# Altium project BEAGLEBONEBLACK.PrjPcb (part 3 of 6)

## Sheet P03_Processor 1 of 3, JTAG Header.SchDoc
size C
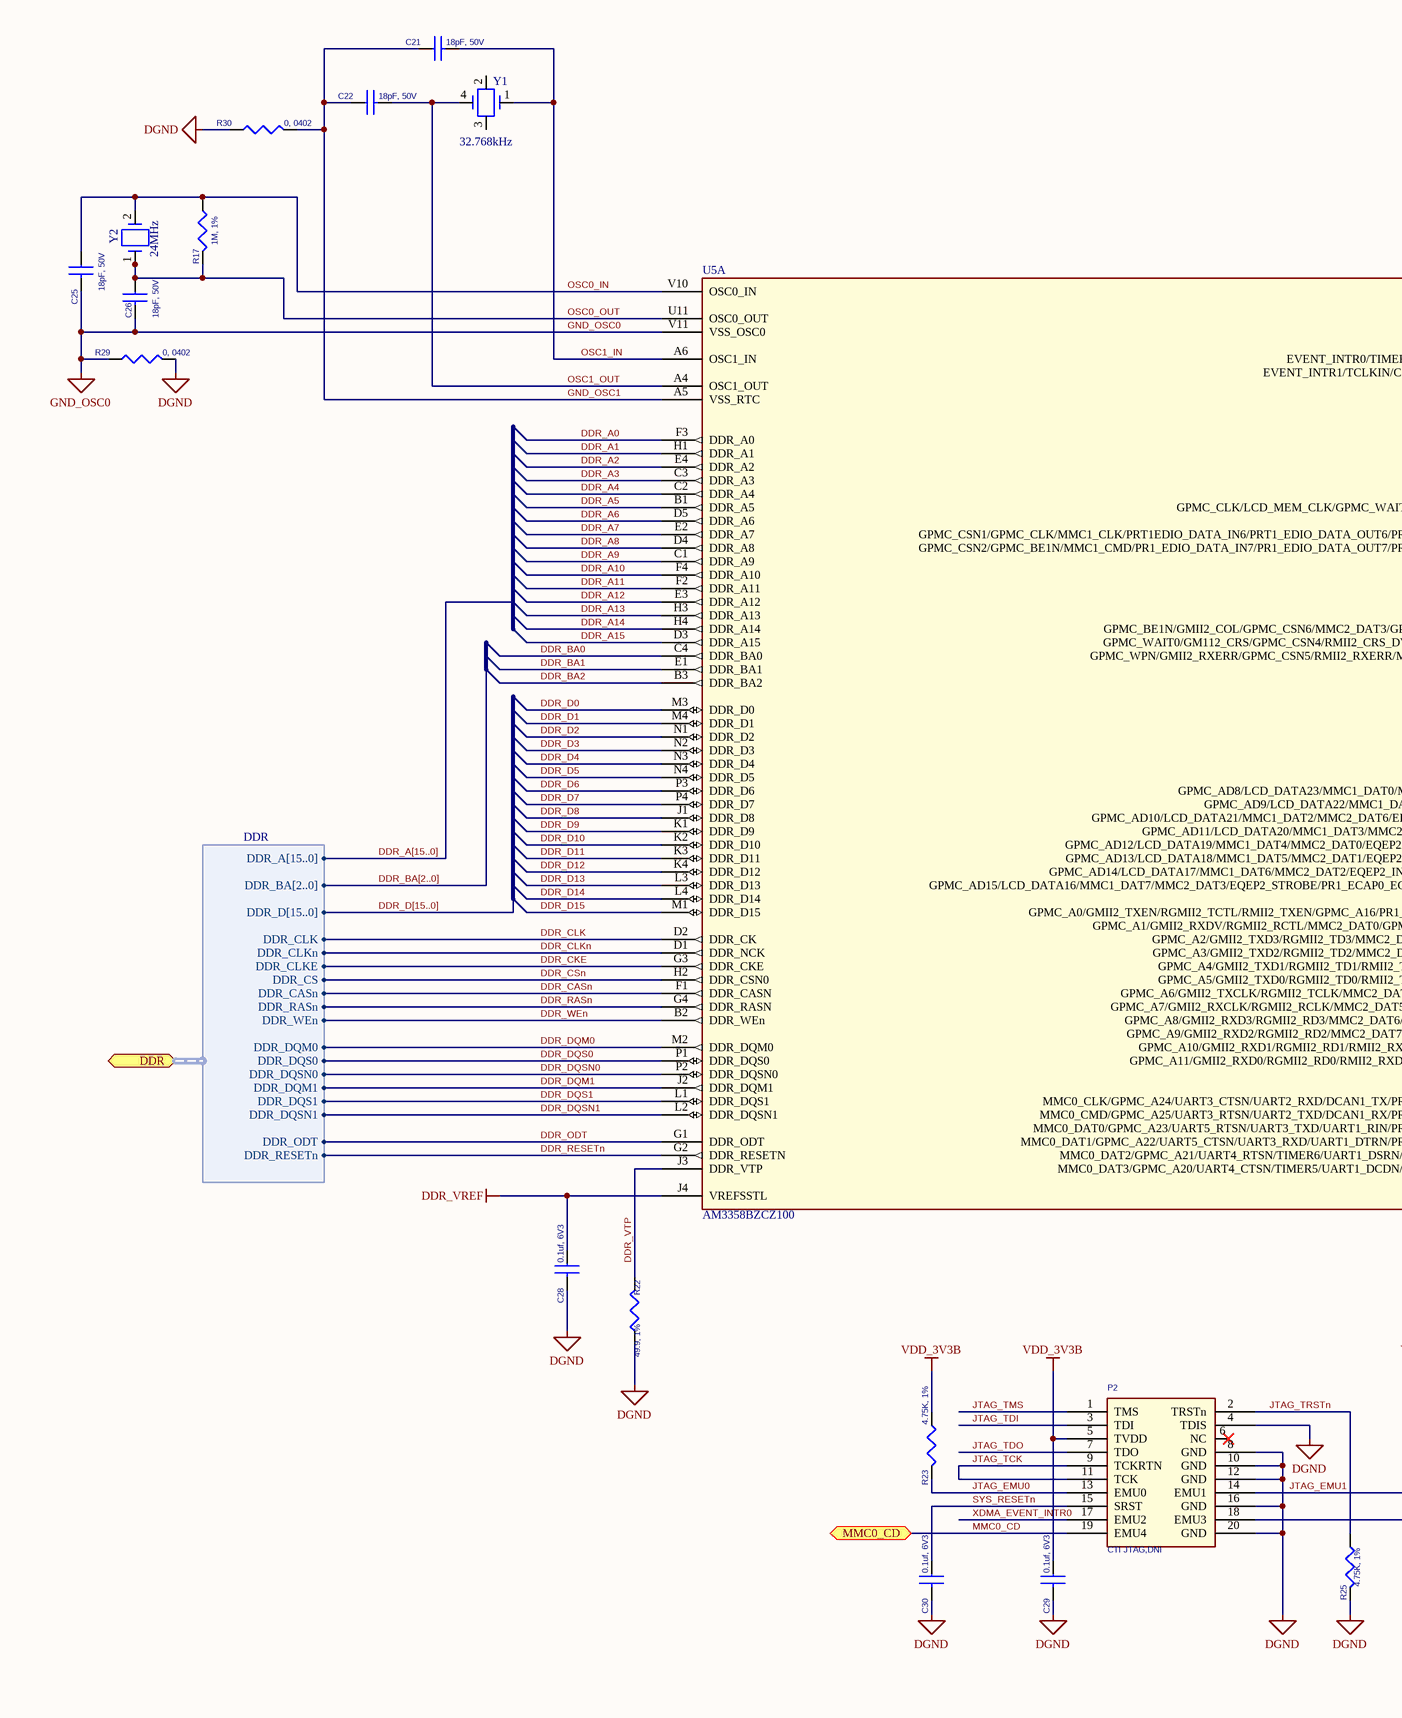
[diagram p7: P03_Processor 1 of 3, JTAG Header.SchDoc, left]
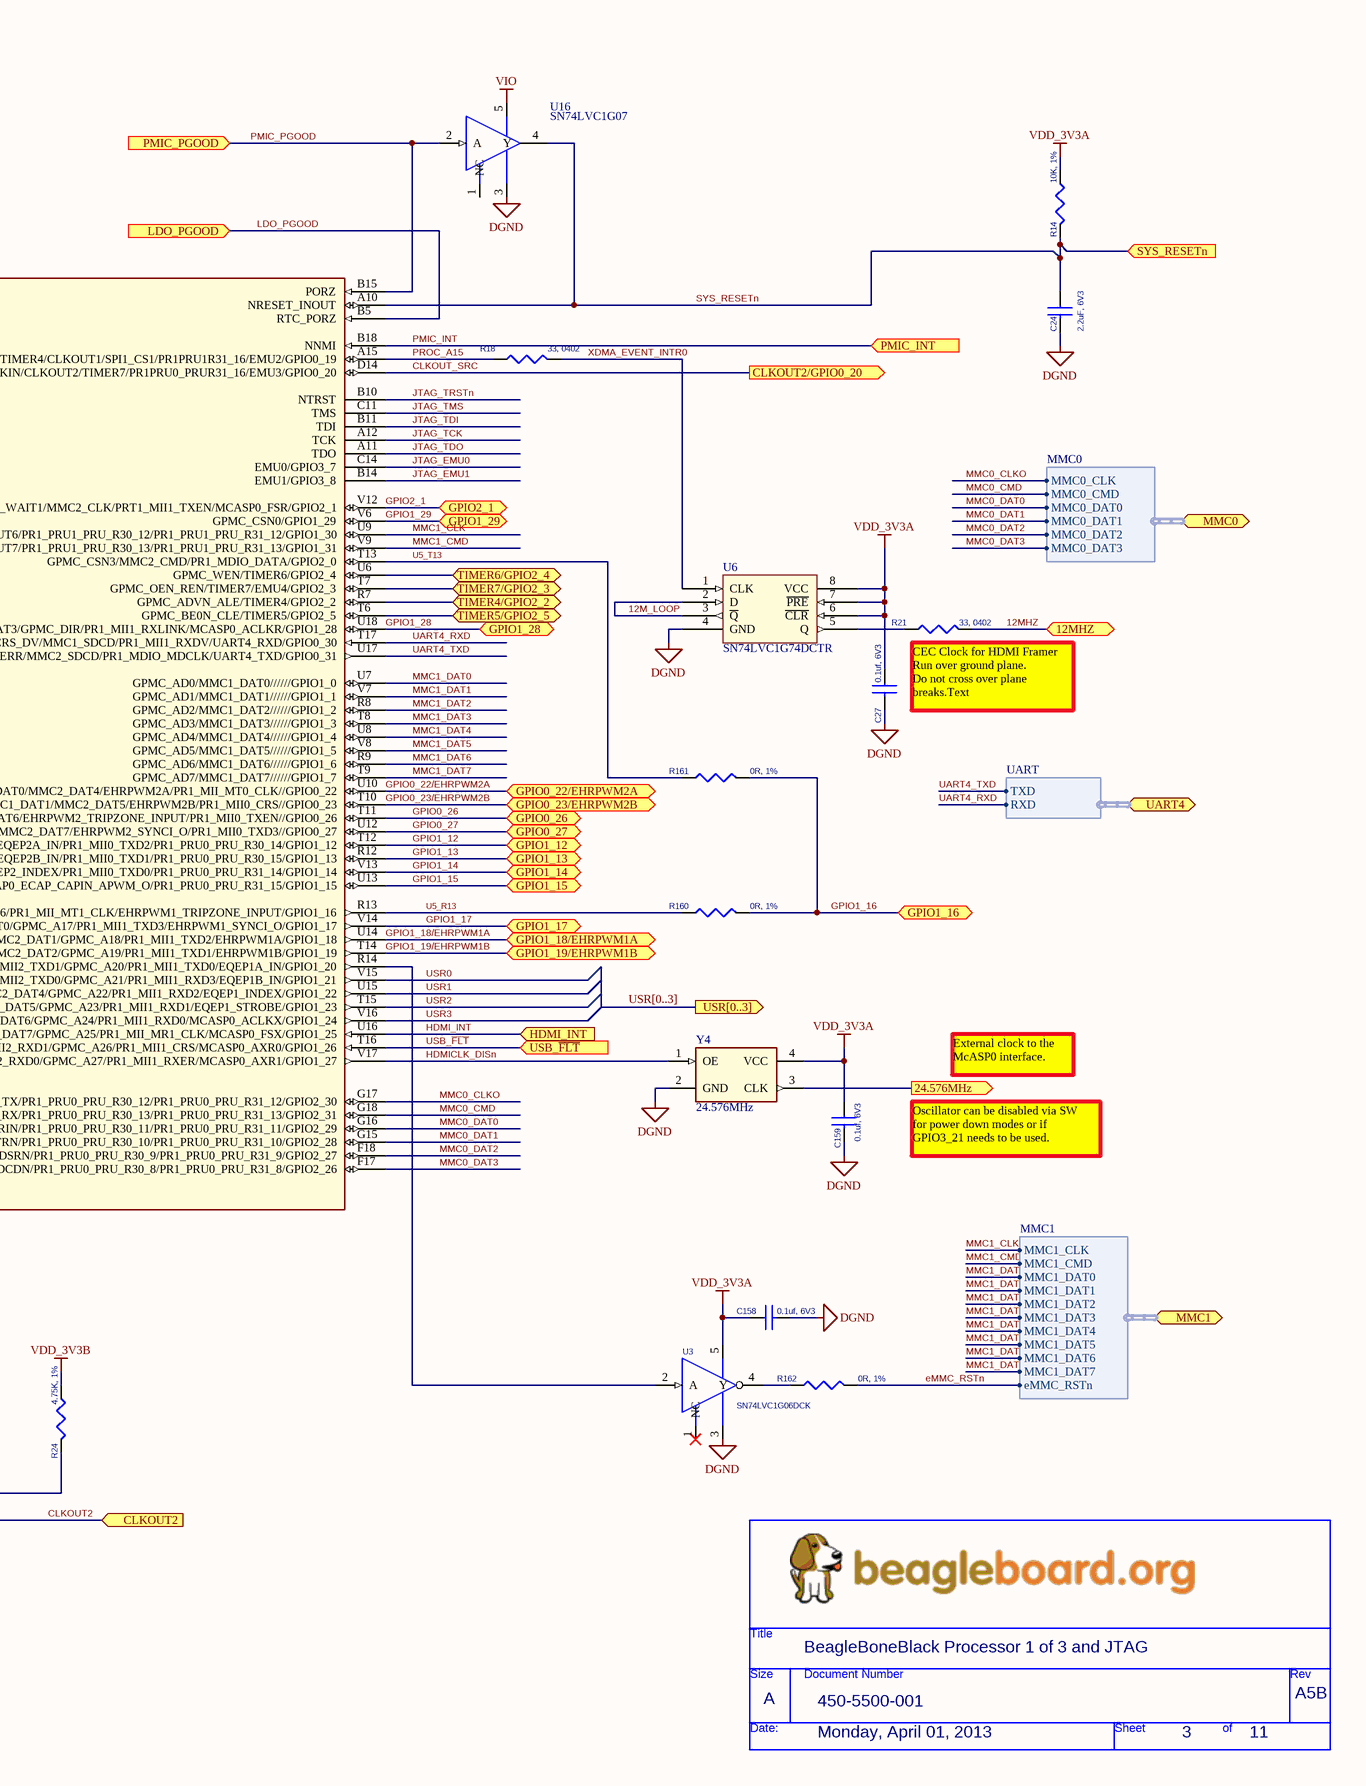
[diagram p8: P03_Processor 1 of 3, JTAG Header.SchDoc, right]

### Parts
(Parts that share a designator on the sheet are numbered #1, #2 ... from top to bottom, then left to right.)
*#6  Page Create Date: Monday, April 01, 2013  Doc: 450-5500-001  RevCode: A5B  Title: BeagleBoneBlack Processor 1 of 3 and JTAG  Page Size: A  Page Number: 3  Page Count: 11  (hidden comment: BeagleBoard_org)  (graphical)
C21  18pF, 50V  [402]
C22  18pF, 50V  [402]
C24  2.2uF, 6V3  [402]
C25  18pF, 50V  [402]
C26  18pF, 50V  [402]
C27  0.1uf, 6V3  [402]
C28  0.1uf, 6V3  [402]
C29  0.1uf, 6V3  [402]
C30  0.1uf, 6V3  [402]
C158  0.1uf, 6V3  [402]
C159  0.1uf, 6V3  [402]
P2  CTI JTAG,DNI  [HEADER10X2_SMD]
R14  10K, 1%  [402]
R17  1M, 1%  [402]
R18  33, 0402  [402]
R21  33, 0402  [402]
R22  49.9, 1%  [402]
R23  4.75K, 1%  [402]
R24  4.75K, 1%  [402]
R25  4.75K, 1%  [402]
R29  0, 0402  [402]
R30  0, 0402  [402]
R160  0R, 1%  [402]
R161  0R, 1%  [402]
R162  0R, 1%  [402]
U3  SN74LVC1G06DCK  [DCK5_2P15X1P4]
U5  AM3358BZCZ100  [am33xx_15x15]  (part A of 3)
U6  SN74LVC1G74DCTR  [SOP8_DCT]
U16  SN74LVC1G07  [DCK5_2P15X1P4]
Y1  32.768kHz  [XTAL4_126-216SMD]
Y2  24MHz  [XTAL150SMD_125X196]
Y4  24.576MHz  [OSC4_61X65LS_79X98SMD]

### Ports
12MHZ, 24.576MHz (out), CLKOUT2 (in), CLKOUT2/GPIO0_20 (out), DDR (harness DDR), GPIO0_22/EHRPWM2A, GPIO0_23/EHRPWM2B, GPIO0_26, GPIO0_27, GPIO1_12, GPIO1_13, GPIO1_14, GPIO1_15, GPIO1_16, GPIO1_17, GPIO1_18/EHRPWM1A, GPIO1_19/EHRPWM1B, GPIO1_28, GPIO1_29, GPIO2_1, HDMI_INT (in), LDO_PGOOD (in), MMC0 (harness MMC0), MMC0_CD, MMC1 (harness MMC1), PMIC_INT (in), PMIC_PGOOD (in), SYS_RESETn (in), TIMER4/GPIO2_2 (bidir), TIMER5/GPIO2_5 (bidir), TIMER6/GPIO2_4 (bidir), TIMER7/GPIO2_3 (bidir), UART4 (harness UART), USB_~{FLT} (in), USR[0..3] (out)

### Harnesses
MMC1: MMC1_CLK, MMC1_CMD, MMC1_DAT0, MMC1_DAT1, MMC1_DAT2, MMC1_DAT3, MMC1_DAT4, MMC1_DAT5, MMC1_DAT6, MMC1_DAT7, eMMC_RSTn
MMC0: MMC0_CLK, MMC0_CMD, MMC0_DAT0, MMC0_DAT1, MMC0_DAT2, MMC0_DAT3
UART: TXD, RXD
DDR: DDR_CLK, DDR_CLKn, DDR_CLKE, DDR_CS, DDR_CASn, DDR_RASn, DDR_WEn, DDR_DQM0, DDR_DQM1, DDR_DQS0, DDR_DQS1, DDR_DQSN0, DDR_DQSN1, DDR_ODT, DDR_RESETn, DDR_D[15..0], DDR_BA[2..0], DDR_A[15..0]

### Nets
DDR_VREF: C28.1 U5.J4(VREFSSTL)
DGND: C24.2 C27.2 C28.2 C29.2 C30.2 C158.2 C159.2 P2.4(TDIS) P2.8(GND) P2.10(GND) P2.12(GND) P2.16(GND) P2.20(GND) R22.1 R25.2 R29.2 R30.1 U3.3(GND) U6.4(GND) U16.3(GND) Y4.2(GND)
GND_OSC0: C25.2 C26.2 R29.1 U5.V11(VSS_OSC0)
VDD_3V3A: C27.1 C158.1 C159.1 R14.1 U3.5(VCC) U6.6(~{CLR}) U6.7(~{PRE}) U6.8(VCC) Y4.4(VCC)
VDD_3V3B: C29.1 P2.5(TVDD) R23.1 R24.1
VIO: U16.5(VCC)
12M_LOOP: U6.2(D) U6.3(~{Q})
12MHZ: R21.2 ; port 12MHZ
CLKOUT2: P2.18(EMU3) ; port CLKOUT2
CLKOUT_SRC: U5.D14(EVENT_INTR1/TCLKIN/CLKOUT2/TIMER7/PR1PRU0_PRUR31_16/EMU3/GPIO0_20) ; port CLKOUT2/GPIO0_20
DDR_A0: U5.F3(DDR_A0)
DDR_A1: U5.H1(DDR_A1)
DDR_A2: U5.E4(DDR_A2)
DDR_A3: U5.C3(DDR_A3)
DDR_A4: U5.C2(DDR_A4)
DDR_A5: U5.B1(DDR_A5)
DDR_A6: U5.D5(DDR_A6)
DDR_A7: U5.E2(DDR_A7)
DDR_A8: U5.D4(DDR_A8)
DDR_A9: U5.C1(DDR_A9)
DDR_A10: U5.F4(DDR_A10)
DDR_A11: U5.F2(DDR_A11)
DDR_A12: U5.E3(DDR_A12)
DDR_A13: U5.H3(DDR_A13)
DDR_A14: U5.H4(DDR_A14)
DDR_A15: U5.D3(DDR_A15)
DDR_BA0: U5.C4(DDR_BA0)
DDR_BA1: U5.E1(DDR_BA1)
DDR_BA2: U5.B3(DDR_BA2)
DDR_CASn: U5.F1(DDR_CASN) ; port DDR.DDR_CASn
DDR_CKE: U5.G3(DDR_CKE) ; port DDR.DDR_CLKE
DDR_CLK: U5.D2(DDR_CK) ; port DDR.DDR_CLK
DDR_CLKn: U5.D1(DDR_NCK) ; port DDR.DDR_CLKn
DDR_CSn: U5.H2(DDR_CSN0) ; port DDR.DDR_CS
DDR_D0: U5.M3(DDR_D0)
DDR_D1: U5.M4(DDR_D1)
DDR_D2: U5.N1(DDR_D2)
DDR_D3: U5.N2(DDR_D3)
DDR_D4: U5.N3(DDR_D4)
DDR_D5: U5.N4(DDR_D5)
DDR_D6: U5.P3(DDR_D6)
DDR_D7: U5.P4(DDR_D7)
DDR_D8: U5.J1(DDR_D8)
DDR_D9: U5.K1(DDR_D9)
DDR_D10: U5.K2(DDR_D10)
DDR_D11: U5.K3(DDR_D11)
DDR_D12: U5.K4(DDR_D12)
DDR_D13: U5.L3(DDR_D13)
DDR_D14: U5.L4(DDR_D14)
DDR_D15: U5.M1(DDR_D15)
DDR_DQM0: U5.M2(DDR_DQM0) ; port DDR.DDR_DQM0
DDR_DQM1: U5.J2(DDR_DQM1) ; port DDR.DDR_DQM1
DDR_DQS0: U5.P1(DDR_DQS0) ; port DDR.DDR_DQS0
DDR_DQS1: U5.L1(DDR_DQS1) ; port DDR.DDR_DQS1
DDR_DQSN0: U5.P2(DDR_DQSN0) ; port DDR.DDR_DQSN0
DDR_DQSN1: U5.L2(DDR_DQSN1) ; port DDR.DDR_DQSN1
DDR_ODT: U5.G1(DDR_ODT) ; port DDR.DDR_ODT
DDR_RASn: U5.G4(DDR_RASN) ; port DDR.DDR_RASn
DDR_RESETn: U5.G2(DDR_RESETN) ; port DDR.DDR_RESETn
DDR_VTP: R22.2 U5.J3(DDR_VTP)
DDR_WEn: U5.B2(DDR_WEn) ; port DDR.DDR_WEn
eMMC_RSTn: R162.2 ; port MMC1.eMMC_RSTn
GND_OSC1: C21.1 C22.1 R30.2 U5.A5(VSS_RTC)
GPIO0_22/EHRPWM2A: U5.U10(GPMC_AD8/LCD_DATA23/MMC1_DAT0/MMC2_DAT4/EHRPWM2A/PR1_MII_MT0_CLK//GPIO0_22) ; port GPIO0_22/EHRPWM2A
GPIO0_23/EHRPWM2B: U5.T10(GPMC_AD9/LCD_DATA22/MMC1_DAT1/MMC2_DAT5/EHRPWM2B/PR1_MII0_CRS//GPIO0_23) ; port GPIO0_23/EHRPWM2B
GPIO0_26: U5.T11(GPMC_AD10/LCD_DATA21/MMC1_DAT2/MMC2_DAT6/EHRPWM2_TRIPZONE_INPUT/PR1_MII0_TXEN//GPIO0_26) ; port GPIO0_26
GPIO0_27: U5.U12(GPMC_AD11/LCD_DATA20/MMC1_DAT3/MMC2_DAT7/EHRPWM2_SYNCI_O/PR1_MII0_TXD3//GPIO0_27) ; port GPIO0_27
GPIO1_12: U5.T12(GPMC_AD12/LCD_DATA19/MMC1_DAT4/MMC2_DAT0/EQEP2A_IN/PR1_MII0_TXD2/PR1_PRU0_PRU_R30_14/GPIO1_12) ; port GPIO1_12
GPIO1_13: U5.R12(GPMC_AD13/LCD_DATA18/MMC1_DAT5/MMC2_DAT1/EQEP2B_IN/PR1_MII0_TXD1/PR1_PRU0_PRU_R30_15/GPIO1_13) ; port GPIO1_13
GPIO1_14: U5.V13(GPMC_AD14/LCD_DATA17/MMC1_DAT6/MMC2_DAT2/EQEP2_INDEX/PR1_MII0_TXD0/PR1_PRU0_PRU_R31_14/GPIO1_14) ; port GPIO1_14
GPIO1_15: U5.U13(GPMC_AD15/LCD_DATA16/MMC1_DAT7/MMC2_DAT3/EQEP2_STROBE/PR1_ECAP0_ECAP_CAPIN_APWM_O/PR1_PRU0_PRU_R31_15/GPIO1_15) ; port GPIO1_15
GPIO1_16: R160.2 R161.2 ; port GPIO1_16
GPIO1_17: U5.V14(GPMC_A1/GMII2_RXDV/RGMII2_RCTL/MMC2_DAT0/GPMC_A17/PR1_MII1_TXD3/EHRPWM1_SYNCI_O/GPIO1_17) ; port GPIO1_17
GPIO1_18/EHRPWM1A: U5.U14(GPMC_A2/GMII2_TXD3/RGMII2_TD3/MMC2_DAT1/GPMC_A18/PR1_MII1_TXD2/EHRPWM1A/GPIO1_18) ; port GPIO1_18/EHRPWM1A
GPIO1_19/EHRPWM1B: U5.T14(GPMC_A3/GMII2_TXD2/RGMII2_TD2/MMC2_DAT2/GPMC_A19/PR1_MII1_TXD1/EHRPWM1B/GPIO1_19) ; port GPIO1_19/EHRPWM1B
GPIO1_28: U5.U18(GPMC_BE1N/GMII2_COL/GPMC_CSN6/MMC2_DAT3/GPMC_DIR/PR1_MII1_RXLINK/MCASP0_ACLKR/GPIO1_28) ; port GPIO1_28
GPIO1_29: U5.V6(GPMC_CSN0/GPIO1_29) ; port GPIO1_29
GPIO2_1: U5.V12(GPMC_CLK/LCD_MEM_CLK/GPMC_WAIT1/MMC2_CLK/PRT1_MII1_TXEN/MCASP0_FSR/GPIO2_1) ; port GPIO2_1
HDMI_INT: U5.U16(GPMC_A9/GMII2_RXD2/RGMII2_RD2/MMC2_DAT7/GPMC_A25/PR1_MII_MR1_CLK/MCASP0_FSX/GPIO1_25) ; port HDMI_INT
HDMICLK_DISn: U5.V17(GPMC_A11/GMII2_RXD0/RGMII2_RD0/RMII2_RXD0/GPMC_A27/PR1_MII1_RXER/MCASP0_AXR1/GPIO1_27) Y4.1(OE)
JTAG_EMU0: P2.13(EMU0) R23.2 U5.C14(EMU0/GPIO3_7)
JTAG_EMU1: P2.14(EMU1) R24.2 U5.B14(EMU1/GPIO3_8)
JTAG_TCK: P2.9(TCKRTN) P2.11(TCK) U5.A12(TCK)
JTAG_TDI: P2.3(TDI) U5.B11(TDI)
JTAG_TDO: P2.7(TDO) U5.A11(TDO)
JTAG_TMS: P2.1(TMS) U5.C11(TMS)
JTAG_TRSTn: P2.2(TRSTn) R25.1 U5.B10(NTRST)
LDO_PGOOD: U5.B5(RTC_PORZ) ; port LDO_PGOOD
MMC0_CD: P2.19(EMU4) ; port MMC0_CD
MMC0_CLKO: U5.G17(MMC0_CLK/GPMC_A24/UART3_CTSN/UART2_RXD/DCAN1_TX/PR1_PRU0_PRU_R30_12/PR1_PRU0_PRU_R31_12/GPIO2_30) ; port MMC0.MMC0_CLK
MMC0_CMD: U5.G18(MMC0_CMD/GPMC_A25/UART3_RTSN/UART2_TXD/DCAN1_RX/PR1_PRU0_PRU_R30_13/PR1_PRU0_PRU_R31_13/GPIO2_31) ; port MMC0.MMC0_CMD
MMC0_DAT0: U5.G16(MMC0_DAT0/GPMC_A23/UART5_RTSN/UART3_TXD/UART1_RIN/PR1_PRU0_PRU_R30_11/PR1_PRU0_PRU_R31_11/GPIO2_29) ; port MMC0.MMC0_DAT0
MMC0_DAT1: U5.G15(MMC0_DAT1/GPMC_A22/UART5_CTSN/UART3_RXD/UART1_DTRN/PR1_PRU0_PRU_R30_10/PR1_PRU0_PRU_R31_10/GPIO2_28) ; port MMC0.MMC0_DAT1
MMC0_DAT2: U5.F18(MMC0_DAT2/GPMC_A21/UART4_RTSN/TIMER6/UART1_DSRN/PR1_PRU0_PRU_R30_9/PR1_PRU0_PRU_R31_9/GPIO2_27) ; port MMC0.MMC0_DAT2
MMC0_DAT3: U5.F17(MMC0_DAT3/GPMC_A20/UART4_CTSN/TIMER5/UART1_DCDN/PR1_PRU0_PRU_R30_8/PR1_PRU0_PRU_R31_8/GPIO2_26) ; port MMC0.MMC0_DAT3
MMC1_CLK: U5.U9(GPMC_CSN1/GPMC_CLK/MMC1_CLK/PRT1EDIO_DATA_IN6/PRT1_EDIO_DATA_OUT6/PR1_PRU1_PRU_R30_12/PR1_PRU1_PRU_R31_12/GPIO1_30) ; port MMC1.MMC1_CLK
MMC1_CMD: U5.V9(GPMC_CSN2/GPMC_BE1N/MMC1_CMD/PR1_EDIO_DATA_IN7/PR1_EDIO_DATA_OUT7/PR1_PRU1_PRU_R30_13/PR1_PRU1_PRU_R31_13/GPIO1_31) ; port MMC1.MMC1_CMD
MMC1_DAT0: U5.U7(GPMC_AD0/MMC1_DAT0//////GPIO1_0) ; port MMC1.MMC1_DAT0
MMC1_DAT1: U5.V7(GPMC_AD1/MMC1_DAT1//////GPIO1_1) ; port MMC1.MMC1_DAT1
MMC1_DAT2: U5.R8(GPMC_AD2/MMC1_DAT2//////GPIO1_2) ; port MMC1.MMC1_DAT2
MMC1_DAT3: U5.T8(GPMC_AD3/MMC1_DAT3//////GPIO1_3) ; port MMC1.MMC1_DAT3
MMC1_DAT4: U5.U8(GPMC_AD4/MMC1_DAT4//////GPIO1_4) ; port MMC1.MMC1_DAT4
MMC1_DAT5: U5.V8(GPMC_AD5/MMC1_DAT5//////GPIO1_5) ; port MMC1.MMC1_DAT5
MMC1_DAT6: U5.R9(GPMC_AD6/MMC1_DAT6//////GPIO1_6) ; port MMC1.MMC1_DAT6
MMC1_DAT7: U5.T9(GPMC_AD7/MMC1_DAT7//////GPIO1_7) ; port MMC1.MMC1_DAT7
OSC0_IN: C25.1 R17.1 U5.V10(OSC0_IN) Y2.2
OSC0_OUT: C26.1 R17.2 U5.U11(OSC0_OUT) Y2.1
OSC1_IN: C21.2 U5.A6(OSC1_IN) Y1.1
OSC1_OUT: C22.2 U5.A4(OSC1_OUT) Y1.4
PMIC_INT: U5.B18(NNMI) ; port PMIC_INT
PMIC_PGOOD: U5.B15(PORZ) U16.2(A) ; port PMIC_PGOOD
PROC_A15: R18.1 U5.A15(EVENT_INTR0/TIMER4/CLKOUT1/SPI1_CS1/PR1PRU1R31_16/EMU2/GPIO0_19)
SYS_RESETn: C24.1 C30.1 P2.15(SRST) R14.2 U5.A10(NRESET_INOUT) U16.4(Y) ; port SYS_RESETn
TIMER4: U5.R7(GPMC_ADVN_ALE/TIMER4/GPIO2_2) ; port TIMER4/GPIO2_2
TIMER5: U5.T6(GPMC_BE0N_CLE/TIMER5/GPIO2_5) ; port TIMER5/GPIO2_5
TIMER6: U5.U6(GPMC_WEN/TIMER6/GPIO2_4) ; port TIMER6/GPIO2_4
TIMER7: U5.T7(GPMC_OEN_REN/TIMER7/EMU4/GPIO2_3) ; port TIMER7/GPIO2_3
U5_R13: R160.1 U5.R13(GPMC_A0/GMII2_TXEN/RGMII2_TCTL/RMII2_TXEN/GPMC_A16/PR1_MII_MT1_CLK/EHRPWM1_TRIPZONE_INPUT/GPIO1_16)
U5_T13: R161.1 U5.T13(GPMC_CSN3/MMC2_CMD/PR1_MDIO_DATA/GPIO2_0)
UART4_RXD: U5.T17(GPMC_WAIT0/GM112_CRS/GPMC_CSN4/RMII2_CRS_DV/MMC1_SDCD/PR1_MII1_RXDV/UART4_RXD/GPIO0_30) ; port UART4.RXD
UART4_TXD: U5.U17(GPMC_WPN/GMII2_RXERR/GPMC_CSN5/RMII2_RXERR/MMC2_SDCD/PR1_MDIO_MDCLK/UART4_TXD/GPIO0_31) ; port UART4.TXD
USB_~{FLT}: U5.T16(GPMC_A10/GMII2_RXD1/RGMII2_RD1/RMII2_RXD1/GPMC_A26/PR1_MII1_CRS/MCASP0_AXR0/GPIO1_26) ; port USB_~{FLT}
USR0: U5.V15(GPMC_A5/GMII2_TXD0/RGMII2_TD0/RMII2_TXD0/GPMC_A21/PR1_MII1_RXD3/EQEP1B_IN/GPIO1_21)
USR1: U5.U15(GPMC_A6/GMII2_TXCLK/RGMII2_TCLK/MMC2_DAT4/GPMC_A22/PR1_MII1_RXD2/EQEP1_INDEX/GPIO1_22)
USR2: U5.T15(GPMC_A7/GMII2_RXCLK/RGMII2_RCLK/MMC2_DAT5/GPMC_A23/PR1_MII1_RXD1/EQEP1_STROBE/GPIO1_23)
USR3: U5.V16(GPMC_A8/GMII2_RXD3/RGMII2_RD3/MMC2_DAT6/GPMC_A24/PR1_MII1_RXD0/MCASP0_ACLKX/GPIO1_24)
XDMA_EVENT_INTR0: P2.17(EMU2) R18.2 U6.1(CLK)
NetR21_1: R21.1 U6.5(Q)
NetR162_1: R162.1 U3.4(Y)
NetU3_2: U3.2(A) U5.R14(GPMC_A4/GMII2_TXD1/RGMII2_TD1/RMII2_TXD1/GPMC_A20/PR1_MII1_TXD0/EQEP1A_IN/GPIO1_20)
NetY4_3: Y4.3(CLK) ; port 24.576MHz

Not connected (* = marked no-connect by the designer): P2 6(NC)*; U3 1(NC)*; U16 1(NC); Y1 2 3

### Buses and harness runs
bus DDR_A[15..0]
bus DDR_BA[2..0]
bus DDR_D[15..0]
bus USR[0..3] = port USR[0..3]

### Notes on the sheet
- (near R21) CEC Clock for HDMI Framer
  Run over ground plane.
  Do not cross over plane
  breaks.Text
- External clock to the
  McASP0 interface.
- Oscillator can be disabled via SW
  for power down modes or if
  GPIO3_21 needs to be used.
- (in symbol BeagleBoard_org) Title; Size; Document Number; Rev; Date:; Sheet; of

### Library data of the parts
C21 C22 C25 C26 = CAP_18PF_COG_50V_5%_0402: CAP CER 18PF 50V 5% NP0 0402; Manufacturer: TDK Corporation; Manufacturer Part Number: C1005C0G1H180J050BA; Temperature Coefficient: C0G, NP0; Supplier 1: Digi-Key; Supplier Part Number 1: 445-1238-6-ND; RoHS: RoHS Compliant; Category: Capacitors; Stock 1: 352554; Pricing 1: 1=0.1, 10=0.024, 100=0.011, 250=0.009, 500=0.0077, 1000=0.006, 5000=0.005 (USD); Capacitance: 18pF; Voltage - Rated: 50V; Tolerance: ±5%; Mounting Type: Surface Mount, MLCC; Operating Temperature: -55°C ~ 125°C; Applications: General Purpose; Ratings: -; Package / Case: 0402 (1005 Metric); Size / Dimension: 0.039" L x 0.020" W (1.00mm x 0.50mm); Height - Seated (Max): -; Thickness (Max): 0.022" (0.55mm); Lead Spacing: -; Features: -; Packaging: Digi-Reel®; Lead Style: -; ComponentLink1URL: http://product.tdk.com/capacitor/mlcc/en/documents/mlcc_commercial_general_en.pdf; ComponentLink1Description: http://product.tdk.com/capacitor/mlcc/en/documents/mlcc_commercial_general_en.pdf
C24 = CAP_2.2uF_X5R_6.3V_10%_0402: CAP CER 2.2UF 6.3V 10% X5R 0402; Manufacturer: TDK Corporation; Manufacturer Part Number: C1005X5R0J225K050BC; Capacitance: 2.2µF; Supplier 1: Digi-Key; Supplier Part Number 1: 445-6847-6-ND; RoHS: RoHS Compliant; Category: Capacitors; Stock 1: 47221; Pricing 1: 1=0.24, 10=0.2, 100=0.1, 250=0.075, 500=0.06626, 1000=0.05875, 5000=0.04875 (USD); Voltage - Rated: 6.3V; Tolerance: ±10%; Temperature Coefficient: X5R; Mounting Type: Surface Mount, MLCC; Operating Temperature: -55°C ~ 85°C; Applications: General Purpose; Ratings: -; Package / Case: 0402 (1005 Metric); Size / Dimension: 0.039" L x 0.020" W (1.00mm x 0.50mm); Height - Seated (Max): -; Thickness (Max): 0.022" (0.55mm); Lead Spacing: -; Features: -; Packaging: Digi-Reel®; Lead Style: -; ComponentLink1URL: http://product.tdk.com/capacitor/mlcc/en/documents/mlcc_commercial_general_en.pdf; ComponentLink1Description: http://product.tdk.com/capacitor/mlcc/en/documents/mlcc_commercial_general_en.pdf
C27-C30 C158 C159 = CAP_0.1uF_X7R_16V_10% 0402: CAP CER 0.1UF 6.3V 10% X5R 0402; Manufacturer: TDK Corporation; Manufacturer Part Number: C1005X5R0J104K050BA; Capacitance: 0.1µF; Supplier 1: Digi-Key; Supplier Part Number 1: 445-1266-6-ND; RoHS: RoHS Compliant; Category: Capacitors; Pricing 1: 1=0.1, 10=0.026, 100=0.0121, 250=0.00992, 500=0.00848, 1000=0.0066, 5000=0.0055 (USD); Voltage - Rated: 6.3V; Tolerance: ±10%; Temperature Coefficient: X5R; Mounting Type: Surface Mount, MLCC; Operating Temperature: -55°C ~ 85°C; Applications: General Purpose; Ratings: -; Package / Case: 0402 (1005 Metric); Size / Dimension: 0.039" L x 0.020" W (1.00mm x 0.50mm); Height - Seated (Max): -; Thickness (Max): 0.022" (0.55mm); Lead Spacing: -; Features: -; Packaging: Digi-Reel®; Lead Style: -; ComponentLink1URL: http://product.tdk.com/capacitor/mlcc/en/documents/mlcc_commercial_general_en.pdf; ComponentLink1Description: http://product.tdk.com/capacitor/mlcc/en/documents/mlcc_commercial_general_en.pdf
  C27-C29 C158 C159: Stock 1: 137886
  C30: Stock 1: 127604
P2 = HDR_10x2_CJTAG: Dual Line Header 10x2pin Tin; Manufacturer: Samtec Inc; Manufacturer Part Number: FTR-110-03-G-D-06; Connector Type: Unshrouded; Number of Positions: 20; Number of Positions Loaded: 19; Pitch: 0.050" (1.27mm); Row Spacing: 0.100" (2.54mm); Supplier 1: Digi-Key; Supplier Part Number 1: FTR-110-03-G-D-06-ND; RoHS: RoHS Compliant; Category: Connectors, Interconnects; Stock 1: 0; Pricing 1: 1=4.47 (USD); Number of Rows: 2; Height Stacking (Mating): -; Molding Height Above Board: 0.100" (2.54mm); Contact Mating Length: 0.125" (3.18mm); Mounting Type: Surface Mount; Termination: Solder; Contact Finish: Gold; Contact Finish Thickness: 10µin (0.25µm); Features: -; Color: Black; Packaging: Tube; ComponentLink1URL: http://www.samtec.com/documents/webfiles/cpdf/FTR-1XX-XX-XX-D-X-XX-MKT.pdf; ComponentLink1Description: http://www.samtec.com/documents/webfiles/cpdf/FTR-1XX-XX-XX-D-X-XX-MKT.pdf
R14 = RES_10K_1/16W_1%_0402: RES 10K OHM 1/16W 5% 0402 SMD; Manufacturer: Rohm Semiconductor; Manufacturer Part Number: MCR01MZPJ103; Power (Watts): 0.063W, 1/16W; Temperature Coefficient: ±200ppm/°C; Supplier 1: Digi-Key; Supplier Part Number 1: RHM10KJDKR-ND; RoHS: RoHS Compliant; Category: Resistors; Stock 1: 110842; Pricing 1: 1=0.1, 10=0.019, 25=0.014, 100=0.0078, 250=0.00596, 500=0.00476, 1000=0.0035, 5000=0.00251 (USD); Resistance (Ohms): 10k; Composition: Thick Film; Features: Automotive AEC-Q200 Qualified; Tolerance: ±5%; Package / Case: 0402 (1005 Metric); Supplier Device Package: 0402 (1005 Metric); Size / Dimension: 0.039" L x 0.020" W (1.00mm x 0.50mm); Height: 0.016" (0.40mm); Number of Terminations: 2; Packaging: Digi-Reel®; ComponentLink1URL: http://rohmfs.rohm.com/en/products/databook/datasheet/passive/resistor/chip_resistor/mcr_a.pdf; ComponentLink1Description: http://rohmfs.rohm.com/en/products/databook/datasheet/passive/resistor/chip_resistor/mcr_a.pdf
R17 = RES_1M_1/16W_1%_0402: Resistor 1Mohm 1/16W 1% 0402; Manufacturer: Stackpole Electronics Inc; Manufacturer Part Number: RMCF0402FT1M00; Power (Watts): 0.063W, 1/16W; Temperature Coefficient: ±100ppm/°C; Supplier 1: Digi-Key; Supplier Part Number 1: RMCF0402FT1M00DKR-ND; RoHS: RoHS Compliant; Category: Resistors; Stock 1: 175650; Pricing 1: 1=0.04, 10=0.025, 50=0.0138, 100=0.0105, 250=0.0078, 500=0.00576, 1000=0.00384, 2500=0.00324, 5000=0.0027 (USD); Resistance (Ohms): 1M; Composition: Thick Film; Features: -; Tolerance: ±1%; Package / Case: 0402 (1005 Metric); Supplier Device Package: 0402; Size / Dimension: 0.039" L x 0.020" W (1.00mm x 0.50mm); Height: 0.016" (0.40mm); Number of Terminations: 2; Packaging: Digi-Reel®; ComponentLink1URL: http://www.seielect.com/Catalog/SEI-RMCF_RMCP.pdf; ComponentLink1Description: http://www.seielect.com/Catalog/SEI-RMCF_RMCP.pdf
R18 R21 = RES_33_0402: RES 33 OHM 1/16W 5% 0402 SMD; Manufacturer: Panasonic Electronic Components; Manufacturer Part Number: ERJ-2GEJ330X; Resistance (Ohms): 33; Power (Watts): 0.1W, 1/10W; Temperature Coefficient: ±200ppm/°C; Supplier 1: Digi-Key; Supplier Part Number 1: P33JDKR-ND; RoHS: RoHS Compliant; Category: Resistors; Stock 1: 5879945; Pricing 1: 1=0.1, 50=0.0172, 100=0.0131, 250=0.00976, 500=0.0072, 1000=0.0048, 5000=0.00338 (USD); Composition: Thick Film; Features: -; Tolerance: ±5%; Package / Case: 0402 (1005 Metric); Supplier Device Package: 0402; Size / Dimension: 0.039" L x 0.020" W (1.00mm x 0.50mm); Height: 0.016" (0.40mm); Number of Terminations: 2; Packaging: Digi-Reel®; ComponentLink1URL: http://industrial.panasonic.com/www-cgi/jvcr13pz.cgi?E+PZ+3+AOA0001+ERJ2GEJ330X+7+WW; ComponentLink1Description: http://industrial.panasonic.com/www-cgi/jvcr13pz.cgi?E+PZ+3+AOA0001+ERJ2GEJ330X+7+WW
R22 = RES_4.7K_0402: RES 49.9 OHM 1/16W 1% 0402 SMD; Manufacturer: Yageo; Manufacturer Part Number: RC0402FR-0749R9L; Resistance (Ohms): 49.9; Power (Watts): 0.063W, 1/16W; Temperature Coefficient: ±100ppm/°C; Supplier 1: Digi-Key; Supplier Part Number 1: 311-49.9LRDKR-ND; RoHS: RoHS Compliant; Category: Resistors; Stock 1: 1338786; Pricing 1: 1=0.1, 10=0.014, 25=0.0104, 100=0.0063, 250=0.0054, 500=0.00382, 1000=0.0027, 2500=0.00234, 5000=0.00203 (USD); Composition: Thick Film; Features: -; Tolerance: ±1%; Package / Case: 0402 (1005 Metric); Supplier Device Package: 0402; Size / Dimension: 0.039" L x 0.020" W (1.00mm x 0.50mm); Height: 0.016" (0.40mm); Number of Terminations: 2; Packaging: Digi-Reel®; ComponentLink1URL: http://www.yageo.com/documents/recent/PYu-RC0402_51_RoHS_L_6.pdf; ComponentLink1Description: http://www.yageo.com/documents/recent/PYu-RC0402_51_RoHS_L_6.pdf
R23-R25 = RES_4.7K_0402: RES 4.75K 1/16W 1% 0402 SMD; Manufacturer: Stackpole Electronics Inc; Manufacturer Part Number: RMCF0402FT4K75; Power (Watts): 0.063W, 1/16W; Temperature Coefficient: ±100ppm/°C; Supplier 1: Digi-Key; Supplier Part Number 1: RMCF0402FT4K75DKR-ND; RoHS: RoHS Compliant; Category: Resistors; Stock 1: 280611; Pricing 1: 1=0.04, 10=0.025, 50=0.0138, 100=0.0105, 250=0.0078, 500=0.00576, 1000=0.00384, 2500=0.00324, 5000=0.0027 (USD); Resistance (Ohms): 4.75k; Composition: Thick Film; Features: -; Tolerance: ±1%; Package / Case: 0402 (1005 Metric); Supplier Device Package: 0402; Size / Dimension: 0.039" L x 0.020" W (1.00mm x 0.50mm); Height: 0.016" (0.40mm); Number of Terminations: 2; Packaging: Digi-Reel®; ComponentLink1URL: http://www.seielect.com/Catalog/SEI-RMCF_RMCP.pdf; ComponentLink1Description: http://www.seielect.com/Catalog/SEI-RMCF_RMCP.pdf
R29 R30 = RES_33_0402: RES 0 OHM 1/16W 5% 0402 SMD; Manufacturer: Panasonic Electronic Components; Manufacturer Part Number: ERJ-2GEJ330X; Resistance (Ohms): 33; Power (Watts): 0.1W, 1/10W; Temperature Coefficient: ±200ppm/°C; Supplier 1: Digi-Key; Supplier Part Number 1: ERJ-2GE0R00X; RoHS: RoHS Compliant; Category: Resistors; Stock 1: 5879945; Pricing 1: 1=0.1, 50=0.0172, 100=0.0131, 250=0.00976, 500=0.0072, 1000=0.0048, 5000=0.00338 (USD); Composition: Thick Film; Features: -; Tolerance: ±5%; Package / Case: 0402 (1005 Metric); Supplier Device Package: 0402; Size / Dimension: 0.039" L x 0.020" W (1.00mm x 0.50mm); Height: 0.016" (0.40mm); Number of Terminations: 2; Packaging: Digi-Reel®; ComponentLink1URL: http://industrial.panasonic.com/www-cgi/jvcr13pz.cgi?E+PZ+3+AOA0001+ERJ2GEJ330X+7+WW; ComponentLink1Description: http://industrial.panasonic.com/www-cgi/jvcr13pz.cgi?E+PZ+3+AOA0001+ERJ2GEJ330X+7+WW
R160-R162 = RES_0_1/16W_1%_0402: RES 0.0 OHM 1/16W 0402 SMD; Manufacturer: Yageo; Manufacturer Part Number: RC0402JR-070RL; Resistance (Ohms): 0.0; Power (Watts): 0.063W, 1/16W; Tolerance: Jumper; Supplier 1: Digi-Key; Supplier Part Number 1: 311-0.0JRDKR-ND; RoHS: RoHS Compliant; Category: Resistors; Stock 1: 4904429; Pricing 1: 1=0.1, 10=0.012, 25=0.0092, 100=0.0055, 250=0.00476, 500=0.00336, 1000=0.00237, 2500=0.00206, 5000=0.00178 (USD); Composition: Thick Film; Features: -; Temperature Coefficient: -; Package / Case: 0402 (1005 Metric); Supplier Device Package: 0402; Size / Dimension: 0.039" L x 0.020" W (1.00mm x 0.50mm); Height: 0.016" (0.40mm); Number of Terminations: 2; Packaging: Digi-Reel®; ComponentLink1URL: http://www.yageo.com/documents/recent/PYu-RC0402_51_RoHS_L_6.pdf; ComponentLink1Description: http://www.yageo.com/documents/recent/PYu-RC0402_51_RoHS_L_6.pdf
U3 = SN74LVC1G06DCK: IC INVERTER SINGLE 1INPUT SC705; Manufacturer: Texas Instruments; Manufacturer Part Number: SN74LVC1G06DCKTG4; Logic Type: Inverter, Buffer; Number of Circuits: 1; Voltage - Supply: 1.65 V ~ 5.5 V; Current - Quiescent (Max): 10µA; Current - Output High, Low: -, 32mA; Logic Level - Low: 0.7 V ~ 0.8 V; Logic Level - High: 1.7 V ~ 2 V; Max Propagation Delay @ V, Max CL: 3ns @ 5V, 50pF; Supplier 1: Digi-Key; Supplier Part Number 1: SN74LVC1G06DCKTG4-ND; RoHS: RoHS Compliant; Category: Integrated Circuits (ICs); Stock 1: 0; Pricing 1: 1250=0.32 (USD); Number of Inputs: 1; Features: Open Drain; Operating Temperature: -40°C ~ 85°C; Mounting Type: Surface Mount; Supplier Device Package: SC-70-5; Package / Case: 6-TSSOP (5 Lead), SC-88A, SOT-353; Packaging: Tape & Reel (TR); ComponentLink1URL: http://www.ti.com/lit/ds/symlink/sn74lvc1g06.pdf; ComponentLink1Description: http://www.ti.com/lit/ds/symlink/sn74lvc1g06.pdf
U5 = IC_AM335X_ZCE_1: IC MPU SITARA 1.0GHZ 324NFBGA; Manufacturer: Texas Instruments; Manufacturer Part Number: XAM3359ZCZ; Processor Type: ARM Microprocessor; Voltage: 1.06 V ~ 1.15 V; Supplier 1: Digi-Key; Supplier Part Number 1: 296-35869-5-ND; RoHS: RoHS Compliant; Category: Integrated Circuits (ICs); Stock 1: 16; Pricing 1: 1=33.5, 10=30.988, 100=26.465, 250=24.28752, 500=23.115, 1000=21.775, 2500=21.105, 5000=20.6025, 10000=20.1 (USD); Features: -; Speed: -; Mounting Type: Surface Mount; Package / Case: 324-LFBGA; Supplier Device Package: 324-NFBGA(15x15); Packaging: Tray; ComponentLink1URL: http://www.ti.com/lit/ds/symlink/am3354.pdf; ComponentLink1Description: http://www.ti.com/lit/ds/symlink/am3354.pdf
U6 = SN74LVC1G74DCTR: SINGLE  POSITIVE-EDGE-TRIGGERED  D-TYPE  FLIP-FLOP WITH  CLEAR  AND  PRESET; Manufacturer: Texas Instruments; Function: Set(Preset) and Reset; Output Type: Differential; Number of Elements: 1; Frequency - Clock: 200MHz; Delay Time - Propagation: 1.6ns; Trigger Type: Positive Edge; Current - Output High, Low: 32mA, 32mA; Voltage - Supply: 1.65 V ~ 5.5 V; Supplier 1: Digi-Key; Supplier Part Number 1: 296-25553-6-ND; Manufacturer Part Number: SN74LVC1G74DCTR; RoHS: RoHS Compliant; Category: Integrated Circuits (ICs); Stock 1: 131; Pricing 1: 1=0.59, 10=0.494, 25=0.4332, 100=0.3708, 250=0.3216, 500=0.2724, 1000=0.21 (USD); Type: D-Type; Number of Bits per Element: 1; Operating Temperature: -40°C ~ 125°C; Mounting Type: Surface Mount; Package / Case: 8-LSSOP (0.11", 2.80mm Width); Packaging: Digi-Reel®; ComponentLink1URL: http://media.digikey.com/pdf/Data%20Sheets/Texas%20Instruments%20PDFs/SN74LVC1G74.pdf; ComponentLink1Description: http://media.digikey.com/pdf/Data%20Sheets/Texas%20Instruments%20PDFs/SN74LVC1G74.pdf
U16 = SN74LVC1G07DCK: IC BUFFER SINGLE 1INPUT SC705; Manufacturer: Texas Instruments; Manufacturer Part Number: SN74LVC1G06DCKTG4; Logic Type: Inverter, Buffer; Number of Circuits: 1; Voltage - Supply: 1.65 V ~ 5.5 V; Current - Quiescent (Max): 10µA; Current - Output High, Low: -, 32mA; Logic Level - Low: 0.7 V ~ 0.8 V; Logic Level - High: 1.7 V ~ 2 V; Max Propagation Delay @ V, Max CL: 3ns @ 5V, 50pF; Supplier 1: Digi-Key; Supplier Part Number 1: SN74LVC1G07DCKTG4-ND; RoHS: RoHS Compliant; Category: Integrated Circuits (ICs); Stock 1: 0; Pricing 1: 1250=0.32 (USD); Number of Inputs: 1; Features: Open Drain; Operating Temperature: -40°C ~ 85°C; Mounting Type: Surface Mount; Supplier Device Package: SC-70-5; Package / Case: 6-TSSOP (5 Lead), SC-88A, SOT-353; Packaging: Tape & Reel (TR); ComponentLink1URL: http://www.ti.com/lit/ds/symlink/sn74lvc1g06.pdf; ComponentLink1Description: http://www.ti.com/lit/ds/symlink/sn74lvc1g06.pdf
Y1 = CRYS_32_768KHz_SMD32: CRYSTAL 32.768KHZ 12.5PF SMD; Manufacturer: Citizen Finetech Miyota; Manufacturer Part Number: CM200C-32.768KAZF-UT; Frequency Tolerance: ±30ppm; ESR (Equivalent Series Resistance): 50 kOhm; Operating Mode: Fundamental; Supplier 1: Digi-Key; Supplier Part Number 1: 300-8738-6-ND; RoHS: RoHS Compliant; Category: Crystals and Oscillators; Stock 1: 0; Pricing 1: 1=0.75, 10=0.65, 50=0.57, 100=0.45, 500=0.38, 1000=0.3 (USD); Type: kHz Crystal (Tuning Fork); Frequency: 32.768kHz; Frequency Stability: -; Load Capacitance: 12.5pF; Operating Temperature: -40°C ~ 85°C; Ratings: -; Mounting Type: Surface Mount; Package / Case: 4-SOJ, 5.50mm pitch; Size / Dimension: 0.311" L x 0.146" W (7.90mm x 3.70mm); Height: 0.098" (2.50mm); Packaging: Digi-Reel®; ComponentLink1URL: http://cfm.citizen.co.jp/english/product/pdf/CM200C_250C.pdf; ComponentLink1Description: http://cfm.citizen.co.jp/english/product/pdf/CM200C_250C.pdf
Y2 = CRYS_24MHz_SCC: CRYSTAL 24.000MHZ 18PF SMD; Manufacturer: TXC CORPORATION; Manufacturer Part Number: 7A-24.000MAAJ-T; Frequency Stability: ±30ppm; ESR (Equivalent Series Resistance): 50 Ohm; Operating Mode: Fundamental; Supplier 1: Digi-Key; Supplier Part Number 1: 887-1090-6-ND; RoHS: RoHS Compliant; Category: Crystals and Oscillators; Stock 1: 2524; Pricing 1: 1=0.79, 10=0.658, 50=0.59, 100=0.525, 500=0.5 (USD); Type: MHz Crystal; Frequency: 24MHz; Frequency Tolerance: ±30ppm; Load Capacitance: 18pF; Operating Temperature: -20°C ~ 70°C; Ratings: -; Mounting Type: Surface Mount; Package / Case: 2-SMD; Size / Dimension: 0.197" L x 0.126" W (5.00mm x 3.20mm); Height: 0.053" (1.35mm); Packaging: Digi-Reel®; ComponentLink1URL: http://www.txccrystal.com/images/pdf/7a.pdf; ComponentLink1Description: http://www.txccrystal.com/images/pdf/7a.pdf
Y4 = ASDMB: Manufacturer: Abracon Corporation; Manufacturer Part Number: ASDMB-24.576MHZ-LC-T; Function: Standby (Power Down); Output: CMOS; Voltage - Supply: 1.8 V ~ 3.3 V; Frequency Stability: ±50ppm; Current - Supply (Max): 16mA; Current - Supply (Disable) (Max): 15µA; Supplier 1: Digi-Key; Supplier Part Number 1: 535-11729-6-ND; RoHS: RoHS Compliant; Category: Crystals and Oscillators; Stock 1: 0; Pricing 1: 1=1.69, 10=1.463, 50=1.2826, 100=1.0125, 500=0.855 (USD); Type: MEMS (Silicon); Frequency: 24.576MHz; Operating Temperature: -40°C ~ 85°C; Ratings: -; Mounting Type: Surface Mount; Size / Dimension: 0.098" L x 0.079" W (2.50mm x 2.00mm); Height: 0.035" (0.90mm); Package / Case: 4-SMD, No Lead (DFN, LCC); Packaging: Digi-Reel®; ComponentLink1URL: http://www.abracon.com/Oscillators/ASDMB.pdf; ComponentLink1Description: http://www.abracon.com/Oscillators/ASDMB.pdf

## Sheet P05_Processor Page 3 of 3.SchDoc
size 513 x 386 mm
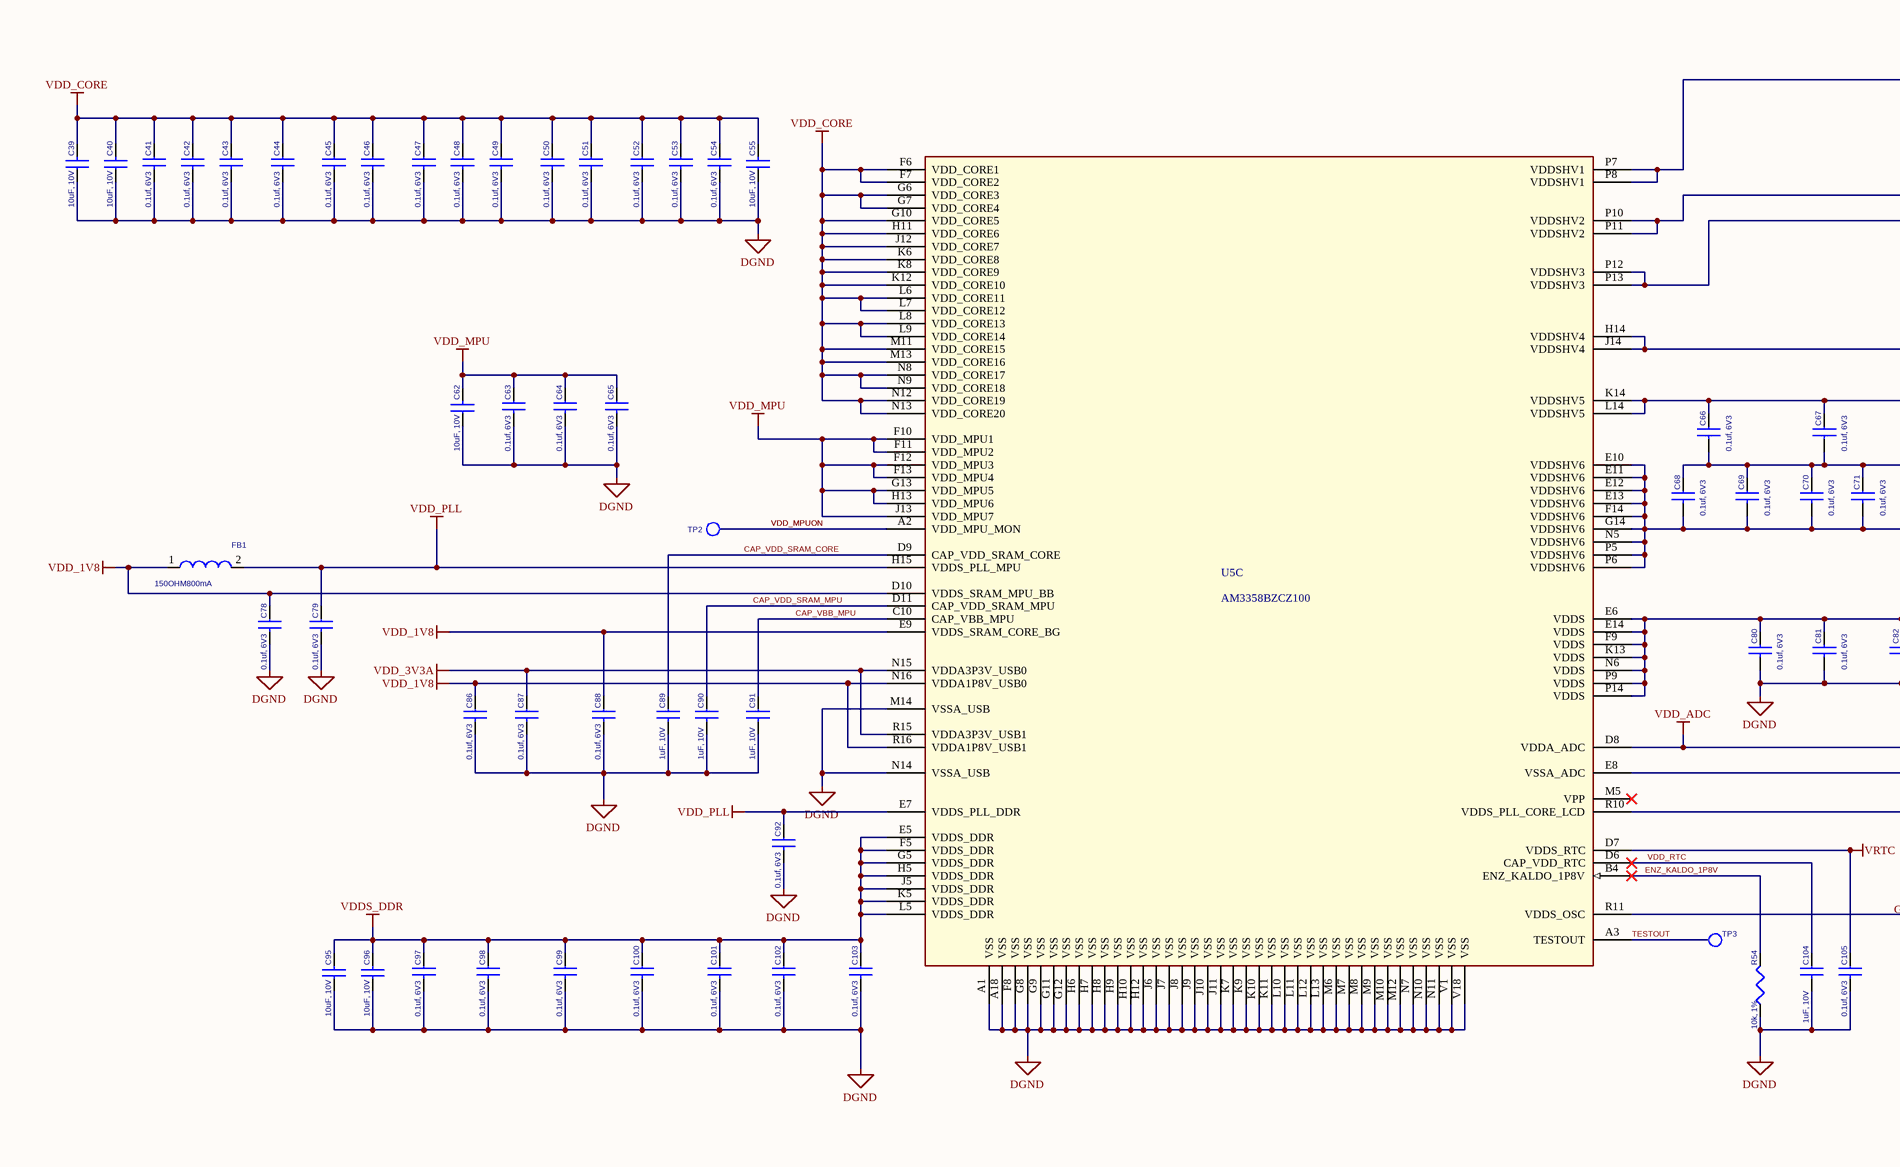
[diagram p9: P05_Processor Page 3 of 3.SchDoc, left]
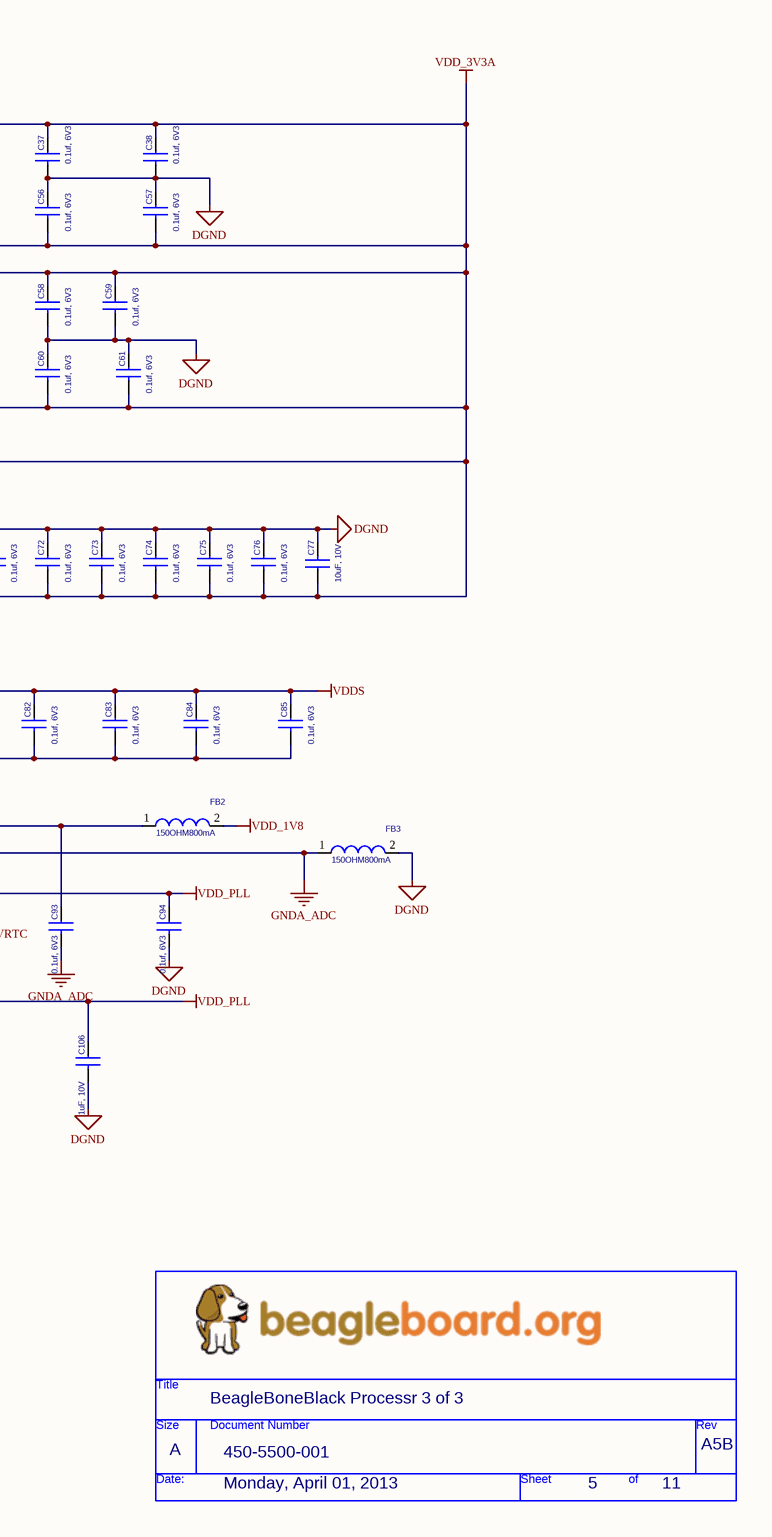
[diagram p10: P05_Processor Page 3 of 3.SchDoc, right]

### Parts
(Parts that share a designator on the sheet are numbered #1, #2 ... from top to bottom, then left to right.)
*#7  Page Create Date: Monday, April 01, 2013  Doc: 450-5500-001  RevCode: A5B  Title: BeagleBoneBlack Processr 3 of 3  Page Size: A  Page Number: 5  Page Count: 11  (hidden comment: BeagleBoard_org)  (graphical)
C37  0.1uf, 6V3  [402]
C38  0.1uf, 6V3  [402]
C39  10uF, 10V  [805]
C40  10uF, 10V  [805]
C41  0.1uf, 6V3  [402]
C42  0.1uf, 6V3  [402]
C43  0.1uf, 6V3  [402]
C44  0.1uf, 6V3  [402]
C45  0.1uf, 6V3  [402]
C46  0.1uf, 6V3  [402]
C47  0.1uf, 6V3  [402]
C48  0.1uf, 6V3  [402]
C49  0.1uf, 6V3  [402]
C50  0.1uf, 6V3  [402]
C51  0.1uf, 6V3  [402]
C52  0.1uf, 6V3  [402]
C53  0.1uf, 6V3  [402]
C54  0.1uf, 6V3  [402]
C55  10uF, 10V  [805]
C56  0.1uf, 6V3  [402]
C57  0.1uf, 6V3  [402]
C58  0.1uf, 6V3  [402]
C59  0.1uf, 6V3  [402]
C60  0.1uf, 6V3  [402]
C61  0.1uf, 6V3  [402]
C62  10uF, 10V  [805]
C63  0.1uf, 6V3  [402]
C64  0.1uf, 6V3  [402]
C65  0.1uf, 6V3  [402]
C66  0.1uf, 6V3  [402]
C67  0.1uf, 6V3  [402]
C68  0.1uf, 6V3  [402]
C69  0.1uf, 6V3  [402]
C70  0.1uf, 6V3  [402]
C71  0.1uf, 6V3  [402]
C72  0.1uf, 6V3  [402]
C73  0.1uf, 6V3  [402]
C74  0.1uf, 6V3  [402]
C75  0.1uf, 6V3  [402]
C76  0.1uf, 6V3  [402]
C77  10uF, 10V  [805]
C78  0.1uf, 6V3  [402]
C79  0.1uf, 6V3  [402]
C80  0.1uf, 6V3  [402]
C81  0.1uf, 6V3  [402]
C82  0.1uf, 6V3  [402]
C83  0.1uf, 6V3  [402]
C84  0.1uf, 6V3  [402]
C85  0.1uf, 6V3  [402]
C86  0.1uf, 6V3  [402]
C87  0.1uf, 6V3  [402]
C88  0.1uf, 6V3  [402]
C89  1uF, 10V  [402]
C90  1uF, 10V  [402]
C91  1uF, 10V  [402]
C92  0.1uf, 6V3  [402]
C93  0.1uf, 6V3  [402]
C94  0.1uf, 6V3  [402]
C95  10uF, 10V  [805]
C96  10uF, 10V  [805]
C97  0.1uf, 6V3  [402]
C98  0.1uf, 6V3  [402]
C99  0.1uf, 6V3  [402]
C100  0.1uf, 6V3  [402]
C101  0.1uf, 6V3  [402]
C102  0.1uf, 6V3  [402]
C103  0.1uf, 6V3  [402]
C104  1uF, 10V  [402]
C105  0.1uf, 6V3  [402]
C106  1uF, 10V  [402]
FB1  150OHM800mA  [SM-7351-IND-0805]
FB2  150OHM800mA  [SM-7351-IND-0805]
FB3  150OHM800mA  [SM-7351-IND-0805]
R54  10k, 1%  [402]
TP2  TESTPT1  [TP60C_SMD]  (value not drawn)  (no BOM)
TP3  TESTPT1  [TP60C_SMD]  (value not drawn)  (no BOM)
U5  AM3358BZCZ100  [am33xx_15x15]  (part C of 3)

### Nets
DGND: C37.2 C38.2 C39.1 C40.1 C41.2 C42.2 C43.2 C44.2 C45.2 C46.2 C47.2 C48.2 C49.2 C50.2 C51.2 C52.2 C53.2 C54.2 C55.1 C56.1 C57.1 C58.2 C59.2 C60.1 C61.1 C62.1 C63.2 C64.2 C65.2 C66.2 C67.2 C68.1 C69.1 C70.1 C71.1 C72.1 C73.1 C74.1 C75.1 C76.1 C77.2 C78.2 C79.2 C80.2 C81.2 C82.2 C83.2 C84.2 C85.2 C86.2 C87.2 C88.2 C89.2 C90.2 C91.2 C92.2 C94.2 C95.1 C96.1 C97.2 C98.2 C99.2 C100.2 C101.2 C102.2 C103.2 C104.2 C105.2 C106.2 FB3.2 R54.1 U5.A1(VSS) U5.A18(VSS) U5.F8(VSS) U5.G8(VSS) U5.G9(VSS) U5.G11(VSS) U5.G12(VSS) U5.H6(VSS) U5.H7(VSS) U5.H8(VSS) U5.H9(VSS) U5.H10(VSS) U5.H12(VSS) U5.J6(VSS) U5.J7(VSS) U5.J8(VSS) U5.J9(VSS) U5.J10(VSS) U5.J11(VSS) U5.K7(VSS) U5.K9(VSS) U5.K10(VSS) U5.K11(VSS) U5.L10(VSS) U5.L11(VSS) U5.L12(VSS) U5.L13(VSS) U5.M6(VSS) U5.M7(VSS) U5.M8(VSS) U5.M9(VSS) U5.M10(VSS) U5.M12(VSS) U5.M14(VSSA_USB) U5.N7(VSS) U5.N10(VSS) U5.N11(VSS) U5.N14(VSSA_USB) U5.V1(VSS) U5.V18(VSS)
GNDA_ADC: C93.2 FB3.1 U5.E8(VSSA_ADC)
VDD_1V8: C78.1 C86.1 C88.1 FB1.1 FB2.2 U5.D10(VDDS_SRAM_MPU_BB) U5.E9(VDDS_SRAM_CORE_BG) U5.N16(VDDA1P8V_USB0) U5.R16(VDDA1P8V_USB1)
VDD_3V3A: C37.1 C38.1 C56.2 C57.2 C58.1 C59.1 C60.2 C61.2 C66.1 C67.1 C68.2 C69.2 C70.2 C71.2 C72.2 C73.2 C74.2 C75.2 C76.2 C77.1 C87.1 U5.E10(VDDSHV6) U5.E11(VDDSHV6) U5.E12(VDDSHV6) U5.E13(VDDSHV6) U5.F14(VDDSHV6) U5.G14(VDDSHV6) U5.H14(VDDSHV4) U5.J14(VDDSHV4) U5.K14(VDDSHV5) U5.L14(VDDSHV5) U5.N5(VDDSHV6) U5.N15(VDDA3P3V_USB0) U5.P5(VDDSHV6) U5.P6(VDDSHV6) U5.P7(VDDSHV1) U5.P8(VDDSHV1) U5.P10(VDDSHV2) U5.P11(VDDSHV2) U5.P12(VDDSHV3) U5.P13(VDDSHV3) U5.R15(VDDA3P3V_USB1)
VDD_ADC: C93.1 FB2.1 U5.D8(VDDA_ADC)
VDD_CORE: C39.2 C40.2 C41.1 C42.1 C43.1 C44.1 C45.1 C46.1 C47.1 C48.1 C49.1 C50.1 C51.1 C52.1 C53.1 C54.1 C55.2 U5.F6(VDD_CORE1) U5.F7(VDD_CORE2) U5.G6(VDD_CORE3) U5.G7(VDD_CORE4) U5.G10(VDD_CORE5) U5.H11(VDD_CORE6) U5.J12(VDD_CORE7) U5.K6(VDD_CORE8) U5.K8(VDD_CORE9) U5.K12(VDD_CORE10) U5.L6(VDD_CORE11) U5.L7(VDD_CORE12) U5.L8(VDD_CORE13) U5.L9(VDD_CORE14) U5.M11(VDD_CORE15) U5.M13(VDD_CORE16) U5.N8(VDD_CORE17) U5.N9(VDD_CORE18) U5.N12(VDD_CORE19) U5.N13(VDD_CORE20)
VDD_MPU: C62.2 C63.1 C64.1 C65.1 U5.F10(VDD_MPU1) U5.F11(VDD_MPU2) U5.F12(VDD_MPU3) U5.F13(VDD_MPU4) U5.G13(VDD_MPU5) U5.H13(VDD_MPU6) U5.J13(VDD_MPU7)
VDD_PLL: C79.1 C92.1 C94.1 C106.1 FB1.2 U5.E7(VDDS_PLL_DDR) U5.H15(VDDS_PLL_MPU) U5.R10(VDDS_PLL_CORE_LCD) U5.R11(VDDS_OSC)
VDDS: C80.1 C81.1 C82.1 C83.1 C84.1 C85.1 U5.E6(VDDS) U5.E14(VDDS) U5.F9(VDDS) U5.K13(VDDS) U5.N6(VDDS) U5.P9(VDDS) U5.P14(VDDS)
VDDS_DDR: C95.2 C96.2 C97.1 C98.1 C99.1 C100.1 C101.1 C102.1 C103.1 U5.E5(VDDS_DDR) U5.F5(VDDS_DDR) U5.G5(VDDS_DDR) U5.H5(VDDS_DDR) U5.J5(VDDS_DDR) U5.K5(VDDS_DDR) U5.L5(VDDS_DDR)
VRTC: C105.1 U5.D7(VDDS_RTC)
CAP_VBB_MPU: C91.1 U5.C10(CAP_VBB_MPU)
CAP_VDD_SRAM_CORE: C89.1 U5.D9(CAP_VDD_SRAM_CORE)
CAP_VDD_SRAM_MPU: C90.1 U5.D11(CAP_VDD_SRAM_MPU)
ENZ_KALDO_1P8V: R54.2 U5.B4(ENZ_KALDO_1P8V)
TESTOUT: TP3.1(TP) U5.A3(TESTOUT)
VDD_MPUON: TP2.1(TP) U5.A2(VDD_MPU_MON)
VDD_RTC: C104.1 U5.D6(CAP_VDD_RTC)

Not connected (* = marked no-connect by the designer): U5 M5(VPP)*

### Notes on the sheet
- (in symbol BeagleBoard_org) Title; Size; Document Number; Rev; Date:; Sheet; of

### Library data of the parts
C37 C38 C41-C54 C56-C61 C63-C76 C78-C88 C92-C94 C97-C103 C105 = CAP_0.1uF_X7R_16V_10% 0402: as C27-C30 on sheet P03_Processor 1 of 3, JTAG Header; Supplier 1: Digi-Key; Supplier Part Number 1: 445-1266-6-ND; RoHS: RoHS Compliant; Category: Capacitors; Stock 1: 127604; Pricing 1: 1=0.1, 10=0.026, 100=0.0121, 250=0.00992, 500=0.00848, 1000=0.0066, 5000=0.0055 (USD); Voltage - Rated: 6.3V; Tolerance: ±10%; Temperature Coefficient: X5R; Mounting Type: Surface Mount, MLCC; Operating Temperature: -55°C ~ 85°C; Applications: General Purpose; Ratings: -; Package / Case: 0402 (1005 Metric); Size / Dimension: 0.039" L x 0.020" W (1.00mm x 0.50mm); Height - Seated (Max): -; Thickness (Max): 0.022" (0.55mm); Lead Spacing: -; Features: -; Packaging: Digi-Reel®; Lead Style: -; ComponentLink1URL: http://www.kemet.com/datasheets&C0402C104K4RACTU; ComponentLink1Description: http://www.kemet.com/datasheets&C0402C104K4RACTU
C39 C55 C62 C77 C95 C96 = CAP_10uF_Y5V_10V_10%_0805: CAP CER 10UF 10V Y5V 0805; Manufacturer: TDK Corporation; Manufacturer Part Number: C2012Y5V1A106Z; Capacitance: 10µF; Tolerance: -20%, +80%; Temperature Coefficient: Y5V (F); Supplier 1: Digi-Key; Supplier Part Number 1: 445-1371-6-ND; RoHS: RoHS Compliant; Category: Capacitors; Stock 1: 111942; Pricing 1: 1=0.15, 10=0.105, 100=0.0499, 250=0.042, 500=0.03518, 1000=0.02887 (USD); Voltage - Rated: 10V; Mounting Type: Surface Mount, MLCC; Operating Temperature: -30°C ~ 85°C; Applications: General Purpose; Ratings: -; Package / Case: 0805 (2012 Metric); Size / Dimension: 0.079" L x 0.049" W (2.00mm x 1.25mm); Height - Seated (Max): -; Thickness (Max): 0.057" (1.45mm); Lead Spacing: -; Features: -; Packaging: Digi-Reel®; Lead Style: -; ComponentLink1URL: http://media.digikey.com/pdf/Data%20Sheets/TDK%20PDFs/C_Series_GeneralAppl_B11.pdf; ComponentLink1Description: http://media.digikey.com/pdf/Data%20Sheets/TDK%20PDFs/C_Series_GeneralAppl_B11.pdf
C40 = CAP_10uF_Y5V_10V_10%_0805: CAP CER 10UF 10V Y5V 0805; Manufacturer: TDK Corporation; Manufacturer Part Number: C2012Y5V1A106Z; Capacitance: 10µF; Temperature Coefficient: Y5V (F); Tolerance: -20%, +80%; Applications: General Purpose; Category: Capacitors; ComponentLink1Description: http://media.digikey.com/pdf/Data%20Sheets/TDK%20PDFs/C_Series_GeneralAppl_B11.pdf; ComponentLink1URL: http://media.digikey.com/pdf/Data%20Sheets/TDK%20PDFs/C_Series_GeneralAppl_B11.pdf; Features: -; Height - Seated (Max): -; Lead Spacing: -; Lead Style: -; Mounting Type: Surface Mount, MLCC; Operating Temperature: -30°C ~ 85°C; Package / Case: 0805 (2012 Metric); Packaging: Digi-Reel®; Pricing 1: 1=0.15, 10=0.105, 100=0.0499, 250=0.042, 500=0.03518, 1000=0.02887 (USD); Ratings: -; RoHS: RoHS Compliant; Size / Dimension: 0.079" L x 0.049" W (2.00mm x 1.25mm); Stock 1: 111942; Supplier 1: Digi-Key; Supplier Part Number 1: 445-1371-6-ND; Thickness (Max): 0.057" (1.45mm); Voltage - Rated: 10V
C89-C91 C104 C106 = CAP_1.0UF_X5R_10V_10%_0402: CAP CER 1UF 10V 10% X5R 0402; Manufacturer: AVX Corporation; Manufacturer Part Number: 0402ZD105KAT2A; Capacitance: 1.0µF; Supplier 1: Digi-Key; Supplier Part Number 1: 478-4596-6-ND; RoHS: RoHS Compliant; Category: Capacitors; Stock 1: 409277; Pricing 1: 1=0.3, 10=0.25, 100=0.125, 250=0.09376, 500=0.08282, 1000=0.07344, 5000=0.06094 (USD); Voltage - Rated: 10V; Tolerance: ±10%; Temperature Coefficient: X5R; Mounting Type: Surface Mount, MLCC; Operating Temperature: -55°C ~ 85°C; Applications: General Purpose; Ratings: -; Package / Case: 0402 (1005 Metric); Size / Dimension: 0.039" L x 0.020" W (1.00mm x 0.50mm); Height - Seated (Max): -; Thickness (Max): 0.022" (0.56mm); Lead Spacing: -; Features: -; Packaging: Digi-Reel®; Lead Style: -; ComponentLink1URL: http://www.avx.com/docs/Catalogs/cx5r.pdf; ComponentLink1Description: http://www.avx.com/docs/Catalogs/cx5r.pdf
FB1-FB3 = FER_180_200_0: FERRITE 800MA 150 OHM 0805 SMD; PartName: FerriteBead150ohm800mA; Mfr: Steward; MfrNum: LI0805H151R-10; TIIntPartnumber: 1L0010; Manufacturer: Laird-Signal Integrity Products; Vendor: Digikey; Impedance @ Frequency: 150 Ohm @ 100MHz; DC Resistance (DCR): 150 mOhm Max; Filter Type: Differential Mode - Single; Supplier 1: Digi-Key; Supplier Part Number 1: 240-2384-6-ND; Manufacturer Part Number: LI0805H151R-10; RoHS: RoHS Compliant; Category: Filters; Stock 1: 3694; Pricing 1: 1=0.1, 10=0.07, 25=0.064, 50=0.0574, 100=0.0421, 250=0.03064, 500=0.02808, 1000=0.02424 (USD); Current Rating: 800mA; Package / Case: 0805 (2012 Metric); Mounting Type: Surface Mount; Packaging: Digi-Reel®; Height (Max): 0.043" (1.10mm); Size / Dimension: 0.079" L x 0.049" W (2.00mm x 1.25mm); ComponentLink1URL: http://www.lairdtech.com/WorkArea/linkit.aspx?LinkIdentifier=id&ItemID=4912; ComponentLink1Description: http://www.lairdtech.com/WorkArea/linkit.aspx?LinkIdentifier=id&ItemID=4912
R54 = RES_10K_1/16W_1%_0402: as R14 on sheet P03_Processor 1 of 3, JTAG Header; Supplier 1: Digi-Key; Supplier Part Number 1: RHM10KJDKR-ND; RoHS: RoHS Compliant; Category: Resistors; Stock 1: 110842; Pricing 1: 1=0.1, 10=0.019, 25=0.014, 100=0.0078, 250=0.00596, 500=0.00476, 1000=0.0035, 5000=0.00251 (USD); Resistance (Ohms): 10k; Composition: Thick Film; Features: Automotive AEC-Q200 Qualified; Tolerance: ±5%; Package / Case: 0402 (1005 Metric); Supplier Device Package: 0402 (1005 Metric); Size / Dimension: 0.039" L x 0.020" W (1.00mm x 0.50mm); Height: 0.016" (0.40mm); Number of Terminations: 2; Packaging: Digi-Reel®; ComponentLink1URL: http://rohmfs.rohm.com/en/products/databook/datasheet/passive/resistor/chip_resistor/mcr_a.pdf; ComponentLink1Description: http://rohmfs.rohm.com/en/products/databook/datasheet/passive/resistor/chip_resistor/mcr_a.pdf
U5 = IC_AM335X_ZCE_1: IC MPU SITARA 1.0GHZ 324NFBGA; PartName: AM335X_15x15; Mfr: TI; MfrNum: AM335x 15x15 FBGA ZCE; TIIntPartnumber: 1A0242; Manufacturer: Texas Instruments; Manufacturer Part Number: XAM3359ZCZ; Vendor: Arrow; Cost100: 10.00; Processor Type: ARM Microprocessor; Voltage: 1.06 V ~ 1.15 V; Cost10K: 10.00; Part Number: IC_AM335x_ZCE; Supplier 1: Digi-Key; Supplier Part Number 1: 296-35073-ND; RoHS: RoHS Compliant; Category: Integrated Circuits (ICs); Stock 1: 16; Pricing 1: 1=33.5, 10=30.988, 100=26.465, 250=24.28752, 500=23.115, 1000=21.775, 2500=21.105, 5000=20.6025, 10000=20.1 (USD); Features: -; Speed: -; Mounting Type: Surface Mount; Package / Case: 324-LFBGA; Supplier Device Package: 324-NFBGA(15x15); Packaging: Tray; ComponentLink1URL: http://www.ti.com/lit/ds/symlink/am3354.pdf; ComponentLink1Description: http://www.ti.com/lit/ds/symlink/am3354.pdf

## Sheet P06_LED, Config, & Button.SchDoc
size 386 x 246 mm
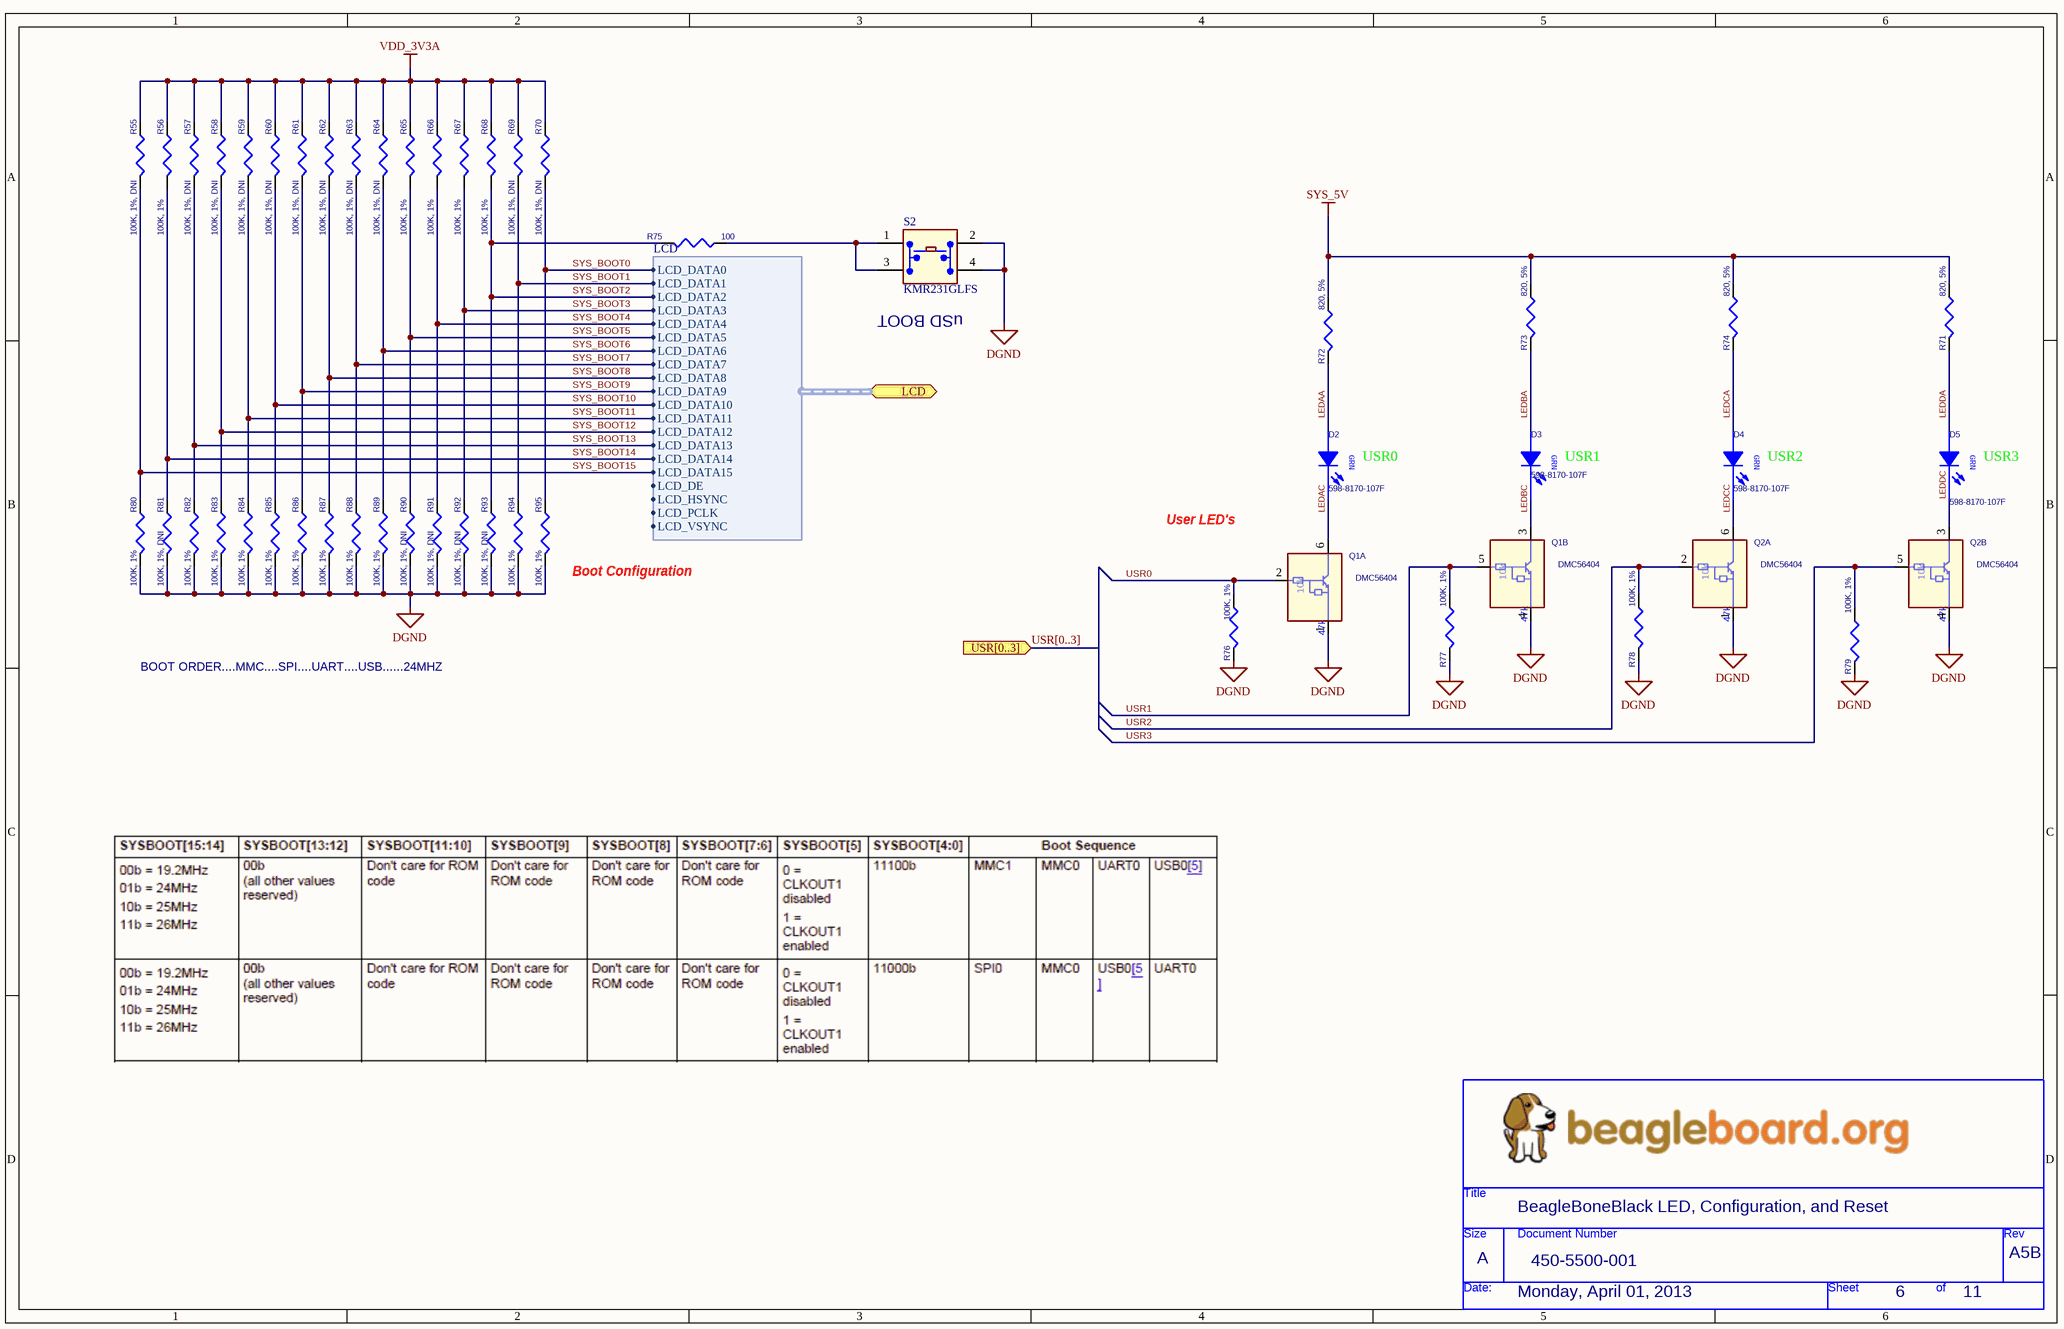
[diagram p11: P06_LED, Config, & Button.SchDoc]

### Parts
(Parts that share a designator on the sheet are numbered #1, #2 ... from top to bottom, then left to right.)
*#8  Page Create Date: Monday, April 01, 2013  Doc: 450-5500-001  RevCode: A5B  Title: BeagleBoneBlack LED, Configuration, and Reset  Page Size: A  Page Number: 6  Page Count: 11  (hidden comment: BeagleBoard_org)  (graphical)
D2  598-8170-107F  [LED_0603]
D3  598-8170-107F  [LED_0603]
D4  598-8170-107F  [LED_0603]
D5  598-8170-107F  [LED_0603]
Q1  DMC56404  [SMini6-F3-B]  (parts A,B of 2)
Q2  DMC56404  [SMini6-F3-B]  (parts A,B of 2)
R55  100K, 1%, DNI  [402]
R56  100K, 1%  [402]
R57  100K, 1%, DNI  [402]
R58  100K, 1%, DNI  [402]
R59  100K, 1%, DNI  [402]
R60  100K, 1%, DNI  [402]
R61  100K, 1%, DNI  [402]
R62  100K, 1%, DNI  [402]
R63  100K, 1%, DNI  [402]
R64  100K, 1%, DNI  [402]
R65  100K, 1%  [402]
R66  100K, 1%  [402]
R67  100K, 1%  [402]
R68  100K, 1%  [402]
R69  100K, 1%, DNI  [402]
R70  100K, 1%, DNI  [402]
R71  820, 5%  [402]
R72  820, 5%  [402]
R73  820, 5%  [402]
R74  820, 5%  [402]
R75  100  [402]
R76  100K, 1%  [402]
R77  100K, 1%  [402]
R78  100K, 1%  [402]
R79  100K, 1%  [402]
R80  100K, 1%  [402]
R81  100K, 1%, DNI  [402]
R82  100K, 1%  [402]
R83  100K, 1%  [402]
R84  100K, 1%  [402]
R85  100K, 1%  [402]
R86  100K, 1%  [402]
R87  100K, 1%  [402]
R88  100K, 1%  [402]
R89  100K, 1%  [402]
R90  100K, 1%, DNI  [402]
R91  100K, 1%, DNI  [402]
R92  100K, 1%, DNI  [402]
R93  100K, 1%, DNI  [402]
R94  100K, 1%  [402]
R95  100K, 1%  [402]
S2  KMR231GLFS  [SW4SMD_63X161LS]

### Ports
LCD (harness LCD), USR[0..3] (in)

### Harnesses
LCD: LCD_DATA0, LCD_DATA1, LCD_DATA10, LCD_DATA11, LCD_DATA12, LCD_DATA13, LCD_DATA14, LCD_DATA15, LCD_DATA2, LCD_DATA3, LCD_DATA4, LCD_DATA5, LCD_DATA6, LCD_DATA7, LCD_DATA8, LCD_DATA9, LCD_DE, LCD_HSYNC, LCD_PCLK, LCD_VSYNC

### Nets
DGND: Q1.1 Q1.4 Q2.1 Q2.4 R76.2 R77.2 R78.2 R79.2 R80.2 R81.2 R82.2 R83.2 R84.2 R85.2 R86.2 R87.2 R88.2 R89.2 R90.2 R91.2 R92.2 R93.2 R94.2 R95.2 S2.2(A2) S2.4
SYS_5V: R71.1 R72.1 R73.1 R74.1
VDD_3V3A: R55.1 R56.1 R57.1 R58.1 R59.1 R60.1 R61.1 R62.1 R63.1 R64.1 R65.1 R66.1 R67.1 R68.1 R69.1 R70.1
LEDAA: D2.2(A) R72.2
LEDAC: D2.1(C) Q1.6
LEDBA: D3.2(A) R73.2
LEDBC: D3.1(C) Q1.3
LEDCA: D4.2(A) R74.2
LEDCC: D4.1(C) Q2.6
LEDDA: D5.2(A) R71.2
LEDDC: D5.1(C) Q2.3
SYS_BOOT0: R70.2 R95.1 ; port LCD.LCD_DATA0  [project net LCD_DATA0]
SYS_BOOT1: R69.2 R94.1 ; port LCD.LCD_DATA1  [project net LCD_DATA1]
SYS_BOOT2: R68.2 R75.1(P1) R93.1 ; port LCD.LCD_DATA2  [project net LCD_DATA2]
SYS_BOOT3: R67.2 R92.1 ; port LCD.LCD_DATA3  [project net LCD_DATA3]
SYS_BOOT4: R66.2 R91.1 ; port LCD.LCD_DATA4  [project net LCD_DATA4]
SYS_BOOT5: R65.2 R90.1 ; port LCD.LCD_DATA5  [project net LCD_DATA5]
SYS_BOOT6: R64.2 R89.1 ; port LCD.LCD_DATA6  [project net LCD_DATA6]
SYS_BOOT7: R63.2 R88.1 ; port LCD.LCD_DATA7  [project net LCD_DATA7]
SYS_BOOT8: R62.2 R87.1 ; port LCD.LCD_DATA8  [project net LCD_DATA8]
SYS_BOOT9: R61.2 R86.1 ; port LCD.LCD_DATA9  [project net LCD_DATA9]
SYS_BOOT10: R60.2 R85.1 ; port LCD.LCD_DATA10  [project net LCD_DATA10]
SYS_BOOT11: R59.2 R84.1 ; port LCD.LCD_DATA11  [project net LCD_DATA11]
SYS_BOOT12: R58.2 R83.1 ; port LCD.LCD_DATA12  [project net LCD_DATA12]
SYS_BOOT13: R57.2 R82.1 ; port LCD.LCD_DATA13  [project net LCD_DATA13]
SYS_BOOT14: R56.2 R81.1 ; port LCD.LCD_DATA14  [project net LCD_DATA14]
SYS_BOOT15: R55.2 R80.1 ; port LCD.LCD_DATA15  [project net LCD_DATA15]
USR0: Q1.2 R76.1
USR1: Q1.5 R77.1
USR2: Q2.2 R78.1
USR3: Q2.5 R79.1
NetR75_2: R75.2(P2) S2.1(A1) S2.3(A3)

### Buses and harness runs
bus USR[0..3] = port USR[0..3]

### Notes on the sheet
- (near S2) uSD BOOT
- (near D2) USR0
- (near D3) USR1
- (near D4) USR2
- (near D5) USR3
- User LED's
- (near R95) Boot Configuration
- BOOT ORDER....MMC....SPI....UART....USB......24MHZ
- (in symbol BeagleBoard_org) Title; Size; Document Number; Rev; Date:; Sheet; of
- (in symbol LED_LTST-C150GKT) GRN

### Library data of the parts
D2-D5 = LED_LTST-C150GKT: LED GREEN CLEAR 0805 SMD; Manufacturer: Lite-On Inc; Manufacturer Part Number: LTST-C170KGKT; CLASS: DISCRETE; TN: 257-0020-000; Current - Test: 20mA; Lens Style/Size: Rectangle with Flat Top, 1.4mm x 1.25mm; Millicandela Rating: 35mcd; Viewing Angle: 130°; Voltage - Forward (Vf) Typ: 2V; Wavelength - Dominant: 571nm; Wavelength - Peak: 574nm; Category: Optoelectronics; Color: Green; ComponentLink1Description: http://optoelectronics.liteon.com/en-us/api/DwonloadFileHandler.ashx?txtSpecNo=DS22-2000-073&txtPartNo=LTST-C170KGKT; ComponentLink1URL: http://optoelectronics.liteon.com/en-us/api/DwonloadFileHandler.ashx?txtSpecNo=DS22-2000-073&txtPartNo=LTST-C170KGKT; Height: 1.10mm; Lens Type: Clear; Luminous Flux @ Current - Test: -; Mounting Type: Surface Mount; Package / Case: 0805 (2012 Metric); Packaging: Digi-Reel®; Pricing 1: 1=0.37, 10=0.267, 100=0.1574, 250=0.11136, 500=0.09504, 1000=0.07425 (USD); RoHS: RoHS Compliant; Size / Dimension: 2.00mm L x 1.25mm W; Stock 1: 274890; Supplier 1: Digi-Key; Supplier Part Number 1: 160-1414-6-ND
Q1 Q2 = RN1907: TRANS PREBIASED DUAL NPN SOT363; Manufacturer: Toshiba; Manufacturer Part Number: DDC114YU-7-F; Order# 2: BCR135S; ATLStockNo1: 2130.0137; ATLStockNo2: 2130.01; Transistor Type: 2 NPN - Pre-Biased (Dual); Current - Collector (Ic) (Max): 100mA; Voltage - Collector Emitter Breakdown (Max): 50V; Resistor - Base (R1) (Ohms): 10k; Resistor - Emitter Base (R2) (Ohms): 47k; DC Current Gain (hFE) (Min) @ Ic, Vce: 68 @ 10mA, 5V; Vce Saturation (Max) @ Ib, Ic: 300mV @ 250µA, 5mA; Current - Collector Cutoff (Max): 500nA; Frequency - Transition: 250MHz; Power - Max: 200mW; Supplier 1: Digi-Key; Supplier Part Number 1: DDC114YU-FDIDKR-ND; RoHS: RoHS Compliant; Category: Discrete Semiconductor Products; Stock 1: 11411; Pricing 1: 1=0.46, 10=0.334, 25=0.2596, 100=0.1966, 250=0.13896, 500=0.11124, 1000=0.08532 (USD); Mounting Type: Surface Mount; Package / Case: 6-TSSOP, SC-88, SOT-363; Supplier Device Package: SOT-363; Packaging: Digi-Reel®; ComponentLink1URL: http://www.diodes.com/datasheets/ds30345.pdf; ComponentLink1Description: http://www.diodes.com/datasheets/ds30345.pdf
R55-R70 R76-R95 = RES_100K_1/16W_1%_0402: RES 100K OHM 1/16W 1% 0402 SMD; Manufacturer: Stackpole Electronics Inc; Manufacturer Part Number: RMCF0402FT100K; Power (Watts): 0.063W, 1/16W; Temperature Coefficient: ±100ppm/°C; Category: Resistors; ComponentLink1Description: http://www.seielect.com/Catalog/SEI-RMCF_RMCP.pdf; ComponentLink1URL: http://www.seielect.com/Catalog/SEI-RMCF_RMCP.pdf; Composition: Thick Film; Features: -; Height: 0.016" (0.40mm); Number of Terminations: 2; Package / Case: 0402 (1005 Metric); Packaging: Digi-Reel®; Pricing 1: 1=0.04, 10=0.025, 50=0.0138, 100=0.0105, 250=0.0078, 500=0.00576, 1000=0.00384, 2500=0.00324, 5000=0.0027 (USD); Resistance (Ohms): 100k; RoHS: RoHS Compliant; Size / Dimension: 0.039" L x 0.020" W (1.00mm x 0.50mm); Stock 1: 851196; Supplier 1: Digi-Key; Supplier Device Package: 0402; Supplier Part Number 1: RMCF0402FT100KDKR-ND; Tolerance: ±1%
R71-R74 = RES_470_1/10W_5%_0402: RES 820 OHM 1/10W 5% 0402 SMD; Manufacturer: Yageo; Manufacturer Part Number: RC0402JR-07820RL; Power (Watts): 0.063W, 1/16W; Resistance (Ohms): 820; Temperature Coefficient: ±100ppm/°C; Category: Resistors; ComponentLink1Description: http://www.yageo.com/documents/recent/PYu-RC0402_51_RoHS_L_6.pdf; ComponentLink1URL: http://www.yageo.com/documents/recent/PYu-RC0402_51_RoHS_L_6.pdf; Composition: Thick Film; Features: -; Height: 0.016" (0.40mm); Number of Terminations: 2; Package / Case: 0402 (1005 Metric); Packaging: Digi-Reel®; Pricing 1: 1=0.1, 10=0.012, 25=0.0092, 100=0.0055, 250=0.00476, 500=0.00336, 1000=0.00237, 2500=0.00206, 5000=0.00178 (USD); RoHS: RoHS Compliant; Size / Dimension: 0.039" L x 0.020" W (1.00mm x 0.50mm); Stock 1: 7437; Supplier 1: Digi-Key; Supplier Device Package: 0402; Supplier Part Number 1: 311-820JRDKR-ND; Tolerance: ±5%
R75 = RES SMD: RES 100 OHM 1/10W 5% 0402 SMD; Manufacturer: Panasonic Electronic Components; Manufacturer Part Number: ERJ-2RKF1000X; Power (Watts): 0.1W, 1/10W; Temperature Coefficient: ±100ppm/°C; Category: Resistors; ComponentLink1Description: http://industrial.panasonic.com/www-cgi/jvcr13pz.cgi?E+PZ+3+AOA0002+ERJ2RKF1000X+7+WW; ComponentLink1URL: http://industrial.panasonic.com/www-cgi/jvcr13pz.cgi?E+PZ+3+AOA0002+ERJ2RKF1000X+7+WW; Composition: Thick Film; Features: -; Height: 0.016" (0.40mm); Number of Terminations: 2; Package / Case: 0402 (1005 Metric); Packaging: Digi-Reel®; Pricing 1: 1=0.1, 50=0.0242, 100=0.0184, 250=0.01364, 500=0.01008, 1000=0.00672, 5000=0.00473 (USD); Resistance (Ohms): 100; RoHS: RoHS; Size / Dimension: 0.039" L x 0.020" W (1.00mm x 0.50mm); Stock 1: 2375521; Supplier 1: Digi-Key; Supplier Device Package: 0402; Supplier Part Number 1: P100LDKR-ND
S2 = KMR2: Microminiature Tact Switch for SMT; Manufacturer: C&K Components; Circuit: SPST-NO; Switch Function: Off-Mom; Contact Rating @ Voltage: 0.05A @ 32VDC; Actuator Type: Standard; Actuator Height off PCB, from Pins: 1.90mm; Actuator Orientation: Top Actuated; Outline: 4.60mm x 2.80mm; Illumination: Non-Illuminated; Operating Force: 300gf; Switch Travel: 0.25mm; Mechanical Life: 150,000 Cycles; Supplier 1: Digi-Key; Supplier Part Number 1: 401-1429-6-ND; Manufacturer Part Number: KMR231GLFS; RoHS: RoHS Compliant; Category: Switches; Stock 1: 32289; Pricing 1: 1=0.44, 10=0.416, 25=0.3744, 50=0.3326, 100=0.3188, 250=0.29108, 500=0.2772, 1000=0.22869 (USD); Mounting Type: Surface Mount; Termination Style: Gull Wing; Illumination Voltage (Nominal): -; Illumination Type, Color: -; Ingress Protection: -; Features: Grounding Pin; Packaging: Digi-Reel®; Actuator Material: -; Operating Temperature: -40°C ~ 85°C; ComponentLink1URL: http://www.ck-components.com/index.php?module=media&action=Display&cmpref=14414&lang=en&width=&height=&format=&alt=; ComponentLink1Description: http://www.ck-components.com/index.php?module=media&action=Display&cmpref=14414&lang=en&width=&height=&format=&alt=